# EAGLE schematic Flexboard (EAGLE 9.7.0), part 1 of 2

## Sheet 1 of 4: Microcontroller
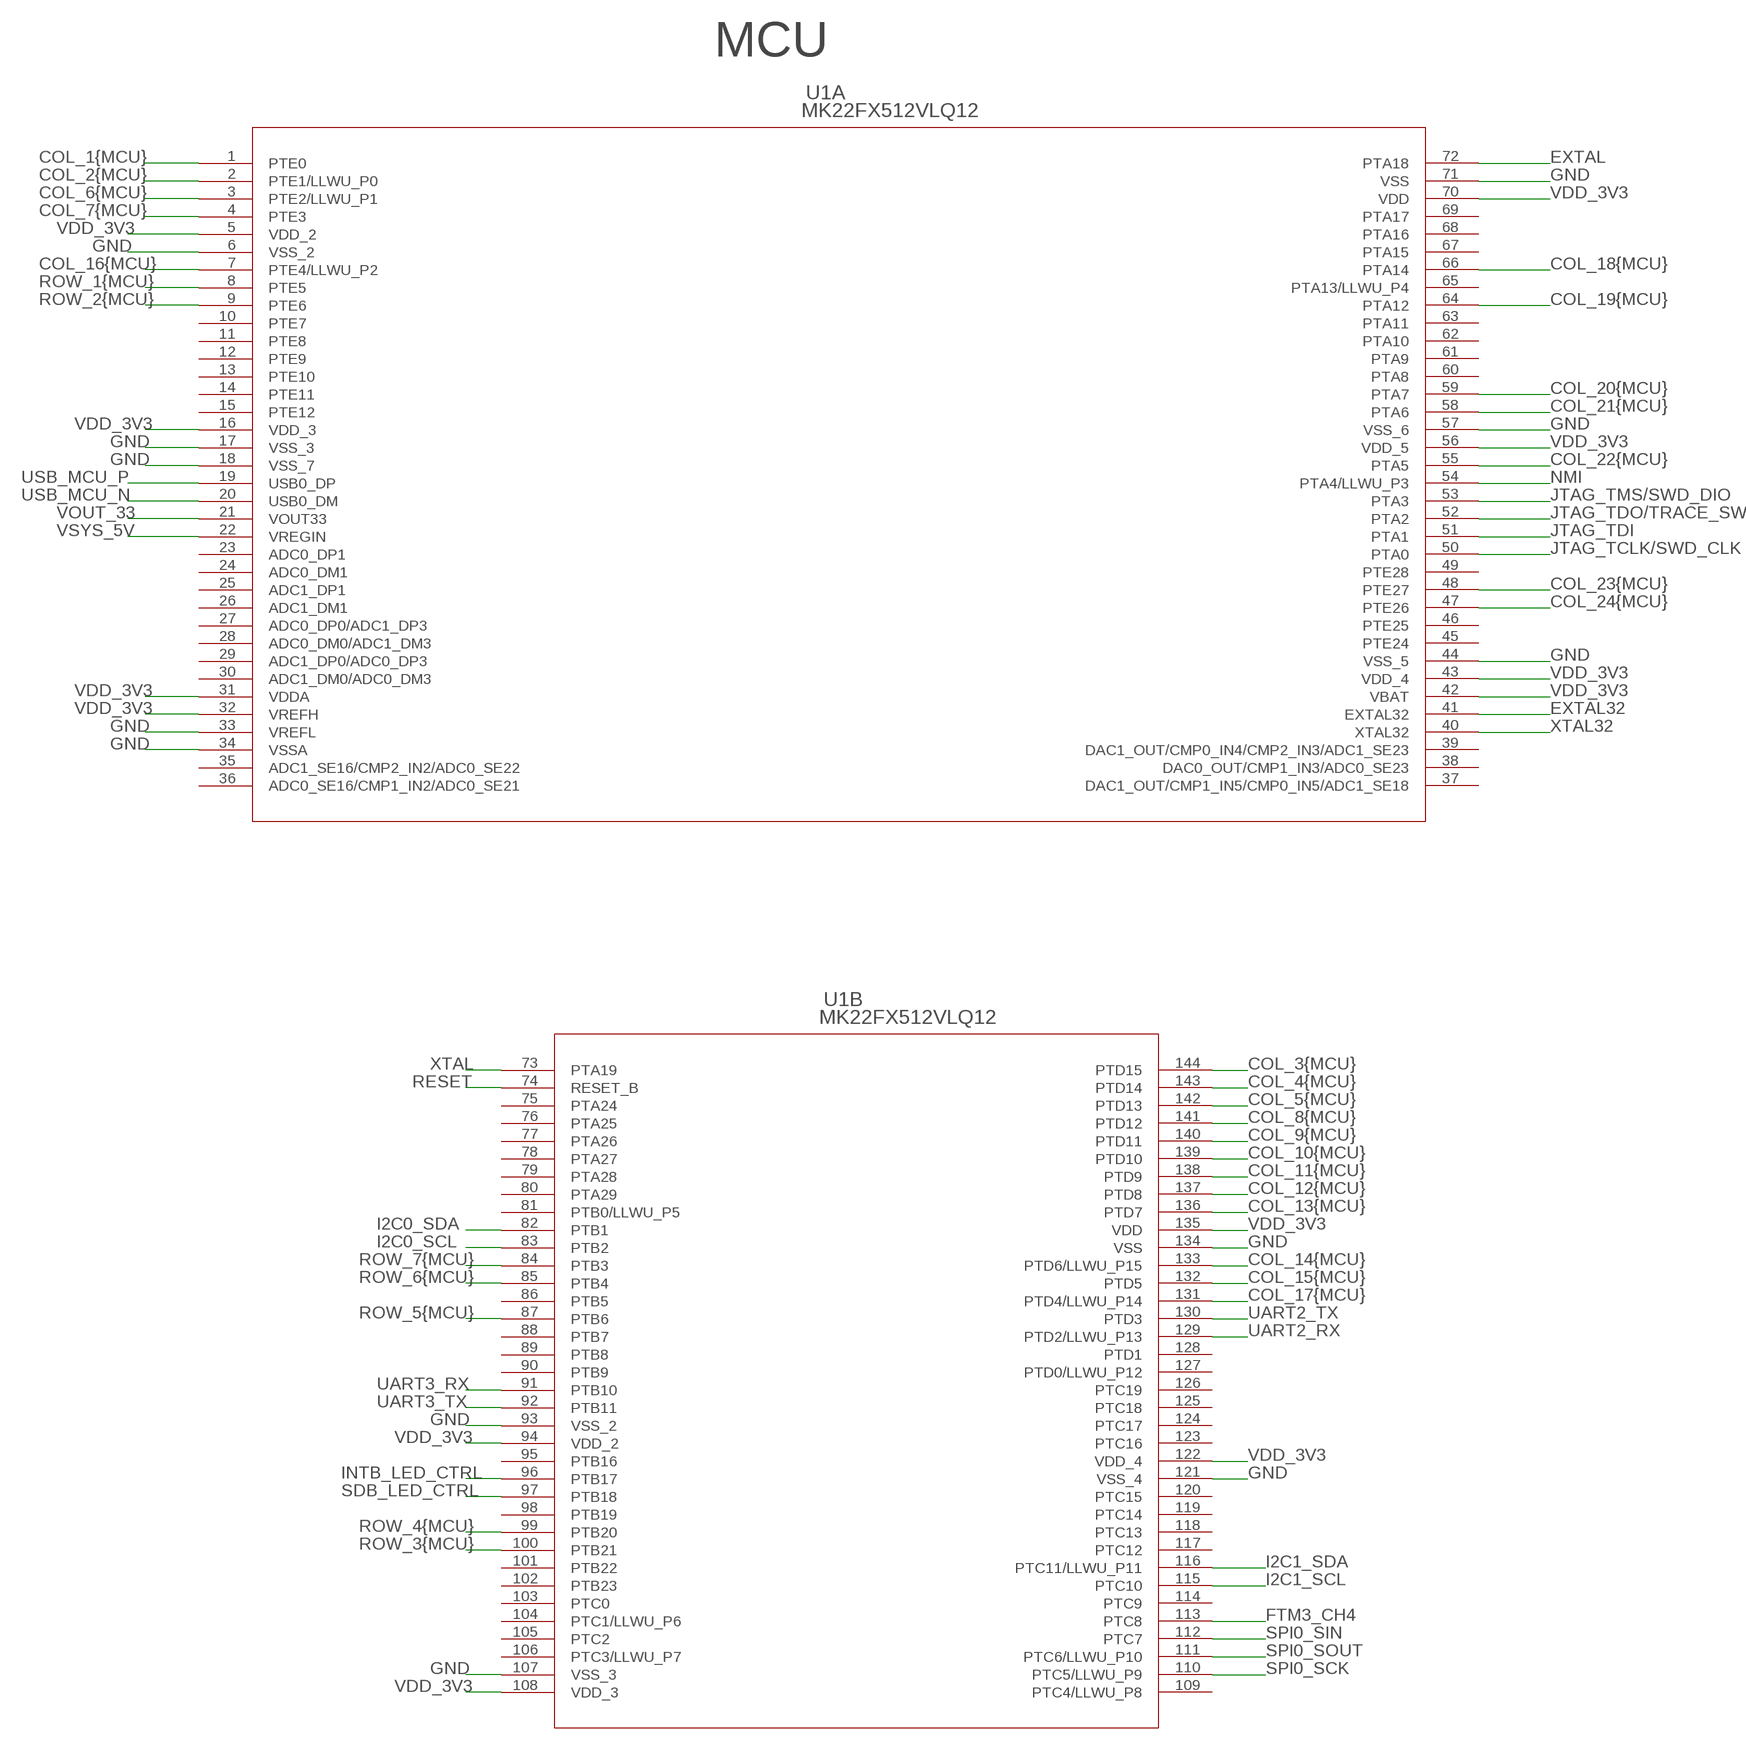
[diagram p0: schematic, sheet 1]

### Parts
U1  MK22FX512VLQ12  MK22FX512AVLQ12  [LQFP-144_20X20X1.6]

### Nets
COL_1{MCU}: U1.1(A:PTE0) ; also sheet 2
COL_2{MCU}: U1.2(A:PTE1/LLWU_P0) ; also sheet 2
COL_3{MCU}: U1.144(B:PTD15) ; also sheet 2
COL_4{MCU}: U1.143(B:PTD14) ; also sheet 2
COL_5{MCU}: U1.142(B:PTD13) ; also sheet 2
COL_6{MCU}: U1.3(A:PTE2/LLWU_P1) ; also sheet 2
COL_7{MCU}: U1.4(A:PTE3) ; also sheet 2
COL_8{MCU}: U1.141(B:PTD12) ; also sheet 2
COL_9{MCU}: U1.140(B:PTD11) ; also sheet 2
COL_10{MCU}: U1.139(B:PTD10) ; also sheet 2
COL_11{MCU}: U1.138(B:PTD9) ; also sheet 2
COL_12{MCU}: U1.137(B:PTD8) ; also sheet 2
COL_13{MCU}: U1.136(B:PTD7) ; also sheet 2
COL_14{MCU}: U1.133(B:PTD6/LLWU_P15) ; also sheet 2
COL_15{MCU}: U1.132(B:PTD5) ; also sheet 2
COL_16{MCU}: U1.7(A:PTE4/LLWU_P2) ; also sheet 2
COL_17{MCU}: U1.131(B:PTD4/LLWU_P14) ; also sheet 2
COL_18{MCU}: U1.66(A:PTA14) ; also sheet 2
COL_19{MCU}: U1.64(A:PTA12) ; also sheet 2
COL_20{MCU}: U1.59(A:PTA7) ; also sheet 2
COL_21{MCU}: U1.58(A:PTA6) ; also sheet 2
COL_22{MCU}: U1.55(A:PTA5) ; also sheet 2
COL_23{MCU}: U1.48(A:PTE27) ; also sheet 2
COL_24{MCU}: U1.47(A:PTE26) ; also sheet 2
EXTAL: U1.72(A:PTA18) ; also sheet 2
EXTAL32: U1.41(A:EXTAL32) ; also sheet 2
FTM3_CH4: U1.113(B:PTC8) ; also sheet 2
GND: U1.6(A:VSS_2) U1.17(A:VSS_3) U1.18(A:VSS_7) U1.33(A:VREFL) U1.34(A:VSSA) U1.44(A:VSS_5) U1.57(A:VSS_6) U1.71(A:VSS) U1.93(B:VSS_2) U1.107(B:VSS_3) U1.121(B:VSS_4) U1.134(B:VSS) ; also sheet 2,4
I2C0_SCL: U1.83(B:PTB2) ; also sheet 4
I2C0_SDA: U1.82(B:PTB1) ; also sheet 4
I2C1_SCL: U1.115(B:PTC10) ; also sheet 2
I2C1_SDA: U1.116(B:PTC11/LLWU_P11) ; also sheet 2
INTB_LED_CTRL: U1.96(B:PTB17) ; also sheet 4
JTAG_TCLK/SWD_CLK: U1.50(A:PTA0) ; also sheet 2
JTAG_TDI: U1.51(A:PTA1) ; also sheet 2
JTAG_TDO/TRACE_SWO: U1.52(A:PTA2) ; also sheet 2
JTAG_TMS/SWD_DIO: U1.53(A:PTA3) ; also sheet 2
NMI: U1.54(A:PTA4/LLWU_P3) ; also sheet 2
RESET: U1.74(B:RESET_B) ; also sheet 2
ROW_1{MCU}: U1.8(A:PTE5) ; also sheet 2
ROW_2{MCU}: U1.9(A:PTE6) ; also sheet 2
ROW_3{MCU}: U1.100(B:PTB21) ; also sheet 2
ROW_4{MCU}: U1.99(B:PTB20) ; also sheet 2
ROW_5{MCU}: U1.87(B:PTB6) ; also sheet 2
ROW_6{MCU}: U1.85(B:PTB4) ; also sheet 2
ROW_7{MCU}: U1.84(B:PTB3) ; also sheet 2
SDB_LED_CTRL: U1.97(B:PTB18) ; also sheet 4
SPI0_SCK: U1.110(B:PTC5/LLWU_P9) ; also sheet 2
SPI0_SIN: U1.112(B:PTC7) ; also sheet 2
SPI0_SOUT: U1.111(B:PTC6/LLWU_P10) ; also sheet 2
UART2_RX: U1.129(B:PTD2/LLWU_P13) ; also sheet 2
UART2_TX: U1.130(B:PTD3) ; also sheet 2
UART3_RX: U1.91(B:PTB10) ; also sheet 2
UART3_TX: U1.92(B:PTB11) ; also sheet 2
USB_MCU_N: U1.20(A:USB0_DM) ; also sheet 2
USB_MCU_P: U1.19(A:USB0_DP) ; also sheet 2
VDD_3V3: U1.5(A:VDD_2) U1.16(A:VDD_3) U1.31(A:VDDA) U1.32(A:VREFH) U1.42(A:VBAT) U1.43(A:VDD_4) U1.56(A:VDD_5) U1.70(A:VDD) U1.94(B:VDD_2) U1.108(B:VDD_3) U1.122(B:VDD_4) U1.135(B:VDD) ; also sheet 2,4
VOUT_33: U1.21(A:VOUT33) ; also sheet 2
VSYS_5V: U1.22(A:VREGIN) ; also sheet 2
XTAL: U1.73(B:PTA19) ; also sheet 2
XTAL32: U1.40(A:XTAL32) ; also sheet 2
Unconnected: U1.10(A:PTE7) U1.11(A:PTE8) U1.12(A:PTE9) U1.13(A:PTE10) U1.14(A:PTE11) U1.15(A:PTE12) U1.23(A:ADC0_DP1) U1.24(A:ADC0_DM1) U1.25(A:ADC1_DP1) U1.26(A:ADC1_DM1) U1.27(A:ADC0_DP0/ADC1_DP3) U1.28(A:ADC0_DM0/ADC1_DM3) U1.29(A:ADC1_DP0/ADC0_DP3) U1.30(A:ADC1_DM0/ADC0_DM3) U1.35(A:ADC1_SE16/CMP2_IN2/ADC0_SE22) U1.36(A:ADC0_SE16/CMP1_IN2/ADC0_SE21) U1.37(A:DAC1_OUT/CMP1_IN5/CMP0_IN5/ADC1_SE18) U1.38(A:DAC0_OUT/CMP1_IN3/ADC0_SE23) U1.39(A:DAC1_OUT/CMP0_IN4/CMP2_IN3/ADC1_SE23) U1.45(A:PTE24) U1.46(A:PTE25) U1.49(A:PTE28) U1.60(A:PTA8) U1.61(A:PTA9) U1.62(A:PTA10) U1.63(A:PTA11) U1.65(A:PTA13/LLWU_P4) U1.67(A:PTA15) U1.68(A:PTA16) U1.69(A:PTA17) U1.75(B:PTA24) U1.76(B:PTA25) U1.77(B:PTA26) U1.78(B:PTA27) U1.79(B:PTA28) U1.80(B:PTA29) U1.81(B:PTB0/LLWU_P5) U1.86(B:PTB5) U1.88(B:PTB7) U1.89(B:PTB8) U1.90(B:PTB9) U1.95(B:PTB16) U1.98(B:PTB19) U1.101(B:PTB22) U1.102(B:PTB23) U1.103(B:PTC0) U1.104(B:PTC1/LLWU_P6) U1.105(B:PTC2) U1.106(B:PTC3/LLWU_P7) U1.109(B:PTC4/LLWU_P8) U1.114(B:PTC9) U1.117(B:PTC12) U1.118(B:PTC13) U1.119(B:PTC14) U1.120(B:PTC15) U1.123(B:PTC16) U1.124(B:PTC17) U1.125(B:PTC18) U1.126(B:PTC19) U1.127(B:PTD0/LLWU_P12) U1.128(B:PTD1)

### Notes on the sheet
- MCU

## Sheet 2 of 4: MCU Support
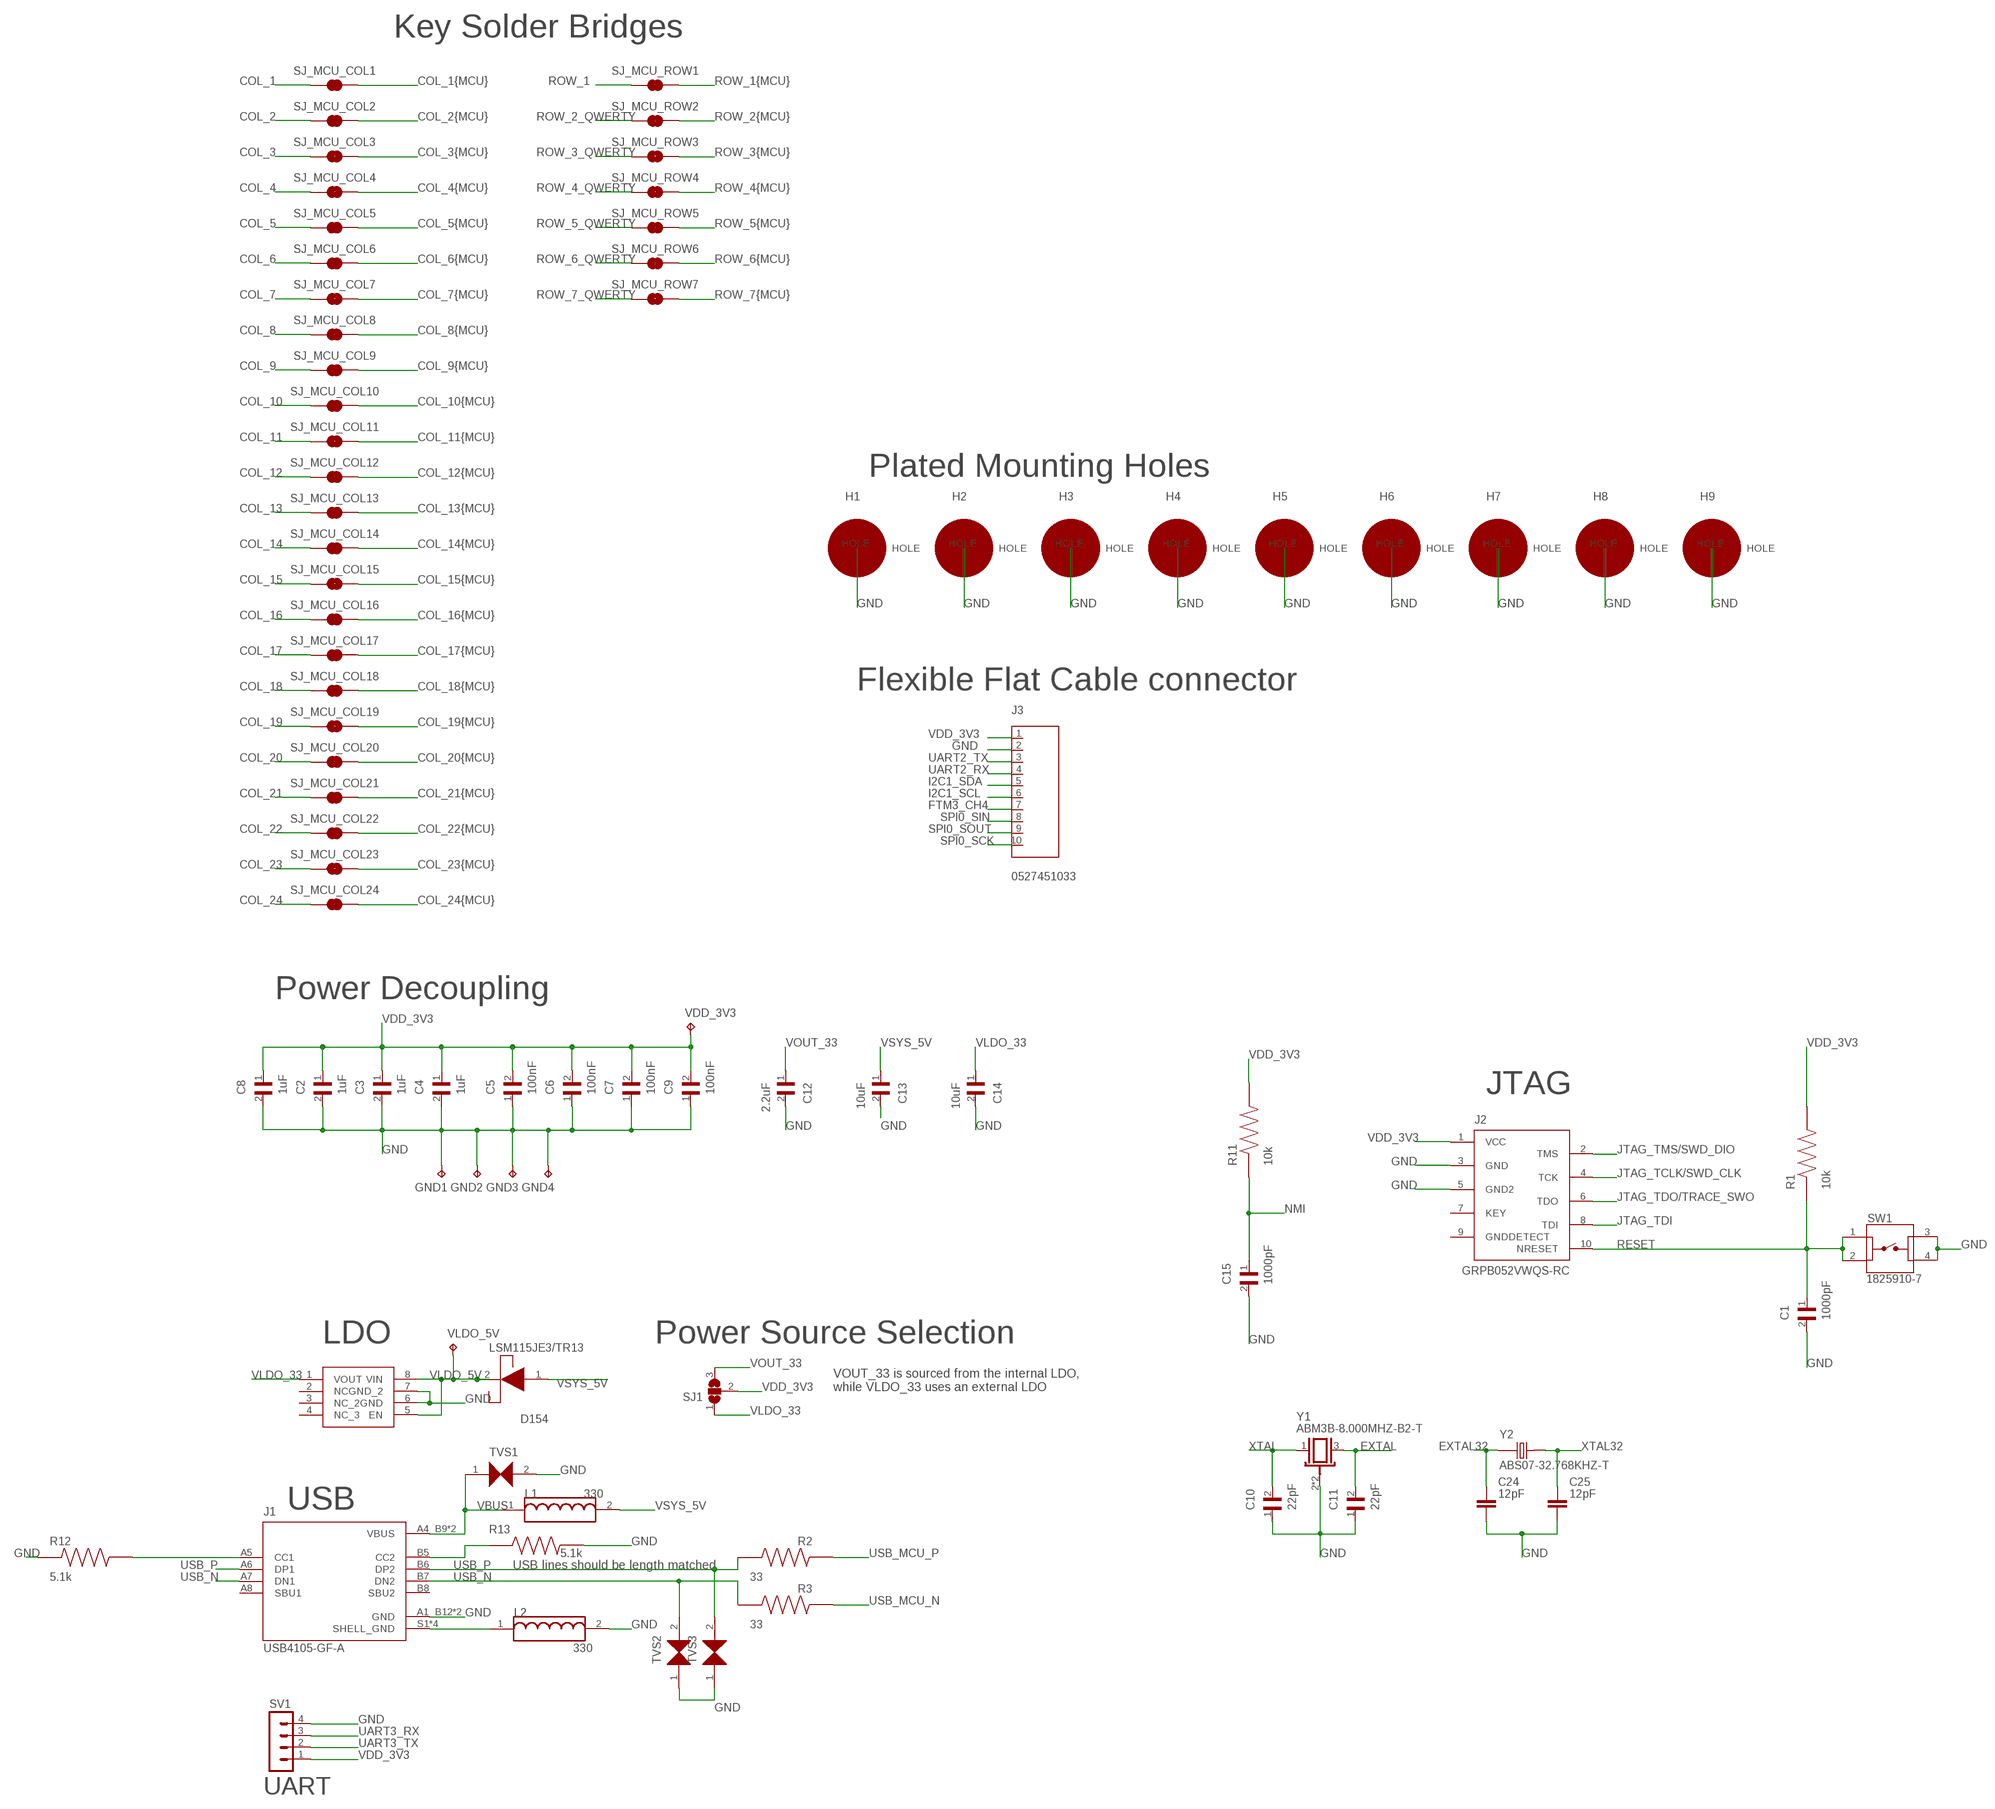
[diagram p1: schematic, sheet 2]

### Parts
C1  1000pF  C1206C102K1RACAUTO  [CAPC3216X110N]
C2  1uF  GCM31MR71H105KA55L  [CAPC3216X125N]
C3  1uF  GCM31MR71H105KA55L  [CAPC3216X125N]
C4  1uF  GCM31MR71H105KA55L  [CAPC3216X125N]
C5  100nF  C1206C104K5RAC7800  [CAPC3216X88N]
C6  100nF  C1206C104K5RAC7800  [CAPC3216X88N]
C7  100nF  C1206C104K5RAC7800  [CAPC3216X88N]
C8  1uF  GCM31MR71H105KA55L  [CAPC3216X125N]
C9  100nF  C1206C104K5RAC7800  [CAPC3216X88N]
C10  22pF  C1206C220JGGAC7800  [CAPC3216X110N]
C11  22pF  C1206C220JGGAC7800  [CAPC3216X110N]
C12  2.2uF  1206ZC225MAT2A  [CAPC3216X178N]
C13  10uF  GRM21BC8YA106ME11L  [CAPC2012X145N]
C14  10uF  GRM21BC8YA106ME11L  [CAPC2012X145N]
C15  1000pF  C1206C102K1RACAUTO  [CAPC3216X110N]
C24  12pF  C_CHIP-0805(2012-METRIC)  [CAPC2012X110]
C25  12pF  C_CHIP-0805(2012-METRIC)  [CAPC2012X110]
D154  LSM115JE3/TR13  [LSM115JE3/TR13]
GND1  TPB2,54  [B2,54]
GND2  TPB2,54  [B2,54]
GND3  TPB2,54  [B2,54]
GND4  TPB2,54  [B2,54]
H1  PTH  [PTH]
H2  PTH  [PTH]
H3  PTH  [PTH]
H4  PTH  [PTH]
H5  PTH  [PTH]
H6  PTH  [PTH]
H7  PTH  [PTH]
H8  PTH  [PTH]
H9  PTH  [PTH]
J1  USB4105-GF-A  [GCT_USB4105-GF-A]
J2  GRPB052VWQS-RC  [DEBUG]
J3  0527451033  [52745-1033]
L1  330  782853331SMD  [78285333]
L2  330  782853331SMD  [78285333]
R1  10k  CRGCQ1206J10K  [RESC3115X65N]
R2  33  CRG0805F33R  [RESC2012X65N]
R3  33  CRG0805F33R  [RESC2012X65N]
R11  10k  CRGCQ1206J10K  [RESC3115X65N]
R12  5.1k  RNCP0805FTD20R0  [RESC2012X60N]
R13  5.1k  RNCP0805FTD20R0  [RESC2012X60N]
SJ1  SJ2W  [SJ_2]
SJ_MCU_COL1  JUMPER-SMT_2_NC_TRACE_NO-SILK  [SMT-JUMPER_2_NC_TRACE_NO-SILK]
SJ_MCU_COL2  JUMPER-SMT_2_NC_TRACE_NO-SILK  [SMT-JUMPER_2_NC_TRACE_NO-SILK]
SJ_MCU_COL3  JUMPER-SMT_2_NC_TRACE_NO-SILK  [SMT-JUMPER_2_NC_TRACE_NO-SILK]
SJ_MCU_COL4  JUMPER-SMT_2_NC_TRACE_NO-SILK  [SMT-JUMPER_2_NC_TRACE_NO-SILK]
SJ_MCU_COL5  JUMPER-SMT_2_NC_TRACE_NO-SILK  [SMT-JUMPER_2_NC_TRACE_NO-SILK]
SJ_MCU_COL6  JUMPER-SMT_2_NC_TRACE_NO-SILK  [SMT-JUMPER_2_NC_TRACE_NO-SILK]
SJ_MCU_COL7  JUMPER-SMT_2_NC_TRACE_NO-SILK  [SMT-JUMPER_2_NC_TRACE_NO-SILK]
SJ_MCU_COL8  JUMPER-SMT_2_NC_TRACE_NO-SILK  [SMT-JUMPER_2_NC_TRACE_NO-SILK]
SJ_MCU_COL9  JUMPER-SMT_2_NC_TRACE_NO-SILK  [SMT-JUMPER_2_NC_TRACE_NO-SILK]
SJ_MCU_COL10  JUMPER-SMT_2_NC_TRACE_NO-SILK  [SMT-JUMPER_2_NC_TRACE_NO-SILK]
SJ_MCU_COL11  JUMPER-SMT_2_NC_TRACE_NO-SILK  [SMT-JUMPER_2_NC_TRACE_NO-SILK]
SJ_MCU_COL12  JUMPER-SMT_2_NC_TRACE_NO-SILK  [SMT-JUMPER_2_NC_TRACE_NO-SILK]
SJ_MCU_COL13  JUMPER-SMT_2_NC_TRACE_NO-SILK  [SMT-JUMPER_2_NC_TRACE_NO-SILK]
SJ_MCU_COL14  JUMPER-SMT_2_NC_TRACE_NO-SILK  [SMT-JUMPER_2_NC_TRACE_NO-SILK]
SJ_MCU_COL15  JUMPER-SMT_2_NC_TRACE_NO-SILK  [SMT-JUMPER_2_NC_TRACE_NO-SILK]
SJ_MCU_COL16  JUMPER-SMT_2_NC_TRACE_NO-SILK  [SMT-JUMPER_2_NC_TRACE_NO-SILK]
SJ_MCU_COL17  JUMPER-SMT_2_NC_TRACE_NO-SILK  [SMT-JUMPER_2_NC_TRACE_NO-SILK]
SJ_MCU_COL18  JUMPER-SMT_2_NC_TRACE_NO-SILK  [SMT-JUMPER_2_NC_TRACE_NO-SILK]
SJ_MCU_COL19  JUMPER-SMT_2_NC_TRACE_NO-SILK  [SMT-JUMPER_2_NC_TRACE_NO-SILK]
SJ_MCU_COL20  JUMPER-SMT_2_NC_TRACE_NO-SILK  [SMT-JUMPER_2_NC_TRACE_NO-SILK]
SJ_MCU_COL21  JUMPER-SMT_2_NC_TRACE_NO-SILK  [SMT-JUMPER_2_NC_TRACE_NO-SILK]
SJ_MCU_COL22  JUMPER-SMT_2_NC_TRACE_NO-SILK  [SMT-JUMPER_2_NC_TRACE_NO-SILK]
SJ_MCU_COL23  JUMPER-SMT_2_NC_TRACE_NO-SILK  [SMT-JUMPER_2_NC_TRACE_NO-SILK]
SJ_MCU_COL24  JUMPER-SMT_2_NC_TRACE_NO-SILK  [SMT-JUMPER_2_NC_TRACE_NO-SILK]
SJ_MCU_ROW1  JUMPER-SMT_2_NC_TRACE_NO-SILK  [SMT-JUMPER_2_NC_TRACE_NO-SILK]
SJ_MCU_ROW2  JUMPER-SMT_2_NC_TRACE_NO-SILK  [SMT-JUMPER_2_NC_TRACE_NO-SILK]
SJ_MCU_ROW3  JUMPER-SMT_2_NC_TRACE_NO-SILK  [SMT-JUMPER_2_NC_TRACE_NO-SILK]
SJ_MCU_ROW4  JUMPER-SMT_2_NC_TRACE_NO-SILK  [SMT-JUMPER_2_NC_TRACE_NO-SILK]
SJ_MCU_ROW5  JUMPER-SMT_2_NC_TRACE_NO-SILK  [SMT-JUMPER_2_NC_TRACE_NO-SILK]
SJ_MCU_ROW6  JUMPER-SMT_2_NC_TRACE_NO-SILK  [SMT-JUMPER_2_NC_TRACE_NO-SILK]
SJ_MCU_ROW7  JUMPER-SMT_2_NC_TRACE_NO-SILK  [SMT-JUMPER_2_NC_TRACE_NO-SILK]
SV1  MA04-1  [MA04-1]
SW1  1825910-7  [SW_1825910-7]
TVS1  0603ESDA2-TR2  [0603ESDA2-TR2]
TVS2  0603ESDA2-TR2  [0603ESDA2-TR2]
TVS3  0603ESDA2-TR2  [0603ESDA2-TR2]
U2  AP2115M-3.3TRG1  [SOIC127P600X175-8N]
VDD_3V3  TPB2,54  [B2,54]
VLDO_5V  TPB2,54  [B2,54]
Y1  ABM3B-8.000MHZ-B2-T  [OSC_ABM3B-8.000MHZ-B2-T]
Y2  ABS07-32.768KHZ-T  [XTAL_ABS07-32.768KHZ-T]

### Nets
COL_1: SJ_MCU_COL1.1 ; also sheet 3
COL_1{MCU}: SJ_MCU_COL1.2 ; also sheet 1
COL_2: SJ_MCU_COL2.1 ; also sheet 3
COL_2{MCU}: SJ_MCU_COL2.2 ; also sheet 1
COL_3: SJ_MCU_COL3.1 ; also sheet 3
COL_3{MCU}: SJ_MCU_COL3.2 ; also sheet 1
COL_4: SJ_MCU_COL4.1 ; also sheet 3
COL_4{MCU}: SJ_MCU_COL4.2 ; also sheet 1
COL_5: SJ_MCU_COL5.1 ; also sheet 3
COL_5{MCU}: SJ_MCU_COL5.2 ; also sheet 1
COL_6: SJ_MCU_COL6.1 ; also sheet 3
COL_6{MCU}: SJ_MCU_COL6.2 ; also sheet 1
COL_7: SJ_MCU_COL7.1 ; also sheet 3
COL_7{MCU}: SJ_MCU_COL7.2 ; also sheet 1
COL_8: SJ_MCU_COL8.1 ; also sheet 3
COL_8{MCU}: SJ_MCU_COL8.2 ; also sheet 1
COL_9: SJ_MCU_COL9.1 ; also sheet 3
COL_9{MCU}: SJ_MCU_COL9.2 ; also sheet 1
COL_10: SJ_MCU_COL10.1 ; also sheet 3
COL_10{MCU}: SJ_MCU_COL10.2 ; also sheet 1
COL_11: SJ_MCU_COL11.1 ; also sheet 3
COL_11{MCU}: SJ_MCU_COL11.2 ; also sheet 1
COL_12: SJ_MCU_COL12.1 ; also sheet 3
COL_12{MCU}: SJ_MCU_COL12.2 ; also sheet 1
COL_13: SJ_MCU_COL13.1 ; also sheet 3
COL_13{MCU}: SJ_MCU_COL13.2 ; also sheet 1
COL_14: SJ_MCU_COL14.1 ; also sheet 3
COL_14{MCU}: SJ_MCU_COL14.2 ; also sheet 1
COL_15: SJ_MCU_COL15.1 ; also sheet 3
COL_15{MCU}: SJ_MCU_COL15.2 ; also sheet 1
COL_16: SJ_MCU_COL16.1 ; also sheet 3
COL_16{MCU}: SJ_MCU_COL16.2 ; also sheet 1
COL_17: SJ_MCU_COL17.1 ; also sheet 3
COL_17{MCU}: SJ_MCU_COL17.2 ; also sheet 1
COL_18: SJ_MCU_COL18.1 ; also sheet 3
COL_18{MCU}: SJ_MCU_COL18.2 ; also sheet 1
COL_19: SJ_MCU_COL19.1 ; also sheet 3
COL_19{MCU}: SJ_MCU_COL19.2 ; also sheet 1
COL_20: SJ_MCU_COL20.1 ; also sheet 3
COL_20{MCU}: SJ_MCU_COL20.2 ; also sheet 1
COL_21: SJ_MCU_COL21.1 ; also sheet 3
COL_21{MCU}: SJ_MCU_COL21.2 ; also sheet 1
COL_22: SJ_MCU_COL22.1 ; also sheet 3
COL_22{MCU}: SJ_MCU_COL22.2 ; also sheet 1
COL_23: SJ_MCU_COL23.1 ; also sheet 3
COL_23{MCU}: SJ_MCU_COL23.2 ; also sheet 1
COL_24: SJ_MCU_COL24.1 ; also sheet 3
COL_24{MCU}: SJ_MCU_COL24.2 ; also sheet 1
EXTAL: C11.2 Y1.3 ; also sheet 1
EXTAL32: C24.1 Y2.1 ; also sheet 1
FTM3_CH4: J3.7 ; also sheet 1
GND: C1.2 C2.2 C3.2 C4.2 C5.1 C6.1 C7.1 C8.2 C9.1 C10.1 C11.1 C12.2 C13.2 C14.2 C15.2 C24.2 C25.2 GND1.TP GND2.TP GND3.TP GND4.TP H1.HOLE H2.HOLE H3.HOLE H4.HOLE H5.HOLE H6.HOLE H7.HOLE H8.HOLE H9.HOLE J1.A1_B12(GND) J1.B1_A12(GND) J2.3(GND) J2.5(GND2) J3.2 L2.2 R12.1 R13.2 SV1.4 SW1.3 SW1.4 TVS1.2 TVS2.1 TVS3.1 U2.6(GND) U2.7(GND_2) Y1.2(GND) Y1.4(GND) ; also sheet 1,4
I2C1_SCL: J3.6 ; also sheet 1
I2C1_SDA: J3.5 ; also sheet 1
JTAG_TCLK/SWD_CLK: J2.4(TCK) ; also sheet 1
JTAG_TDI: J2.8(TDI) ; also sheet 1
JTAG_TDO/TRACE_SWO: J2.6(TDO) ; also sheet 1
JTAG_TMS/SWD_DIO: J2.2(TMS) ; also sheet 1
N$1: J1.S1(SHELL_GND) J1.S2(SHELL_GND) J1.S3(SHELL_GND) J1.S4(SHELL_GND) L2.1
N$214: J1.B5(CC2) R13.1
N$215: J1.A5(CC1) R12.2
NMI: C15.1 R11.1 ; also sheet 1
RESET: C1.1 J2.10(NRESET) R1.1 SW1.1 SW1.2 ; also sheet 1
ROW_1: SJ_MCU_ROW1.1 ; also sheet 3
ROW_1{MCU}: SJ_MCU_ROW1.2 ; also sheet 1
ROW_2_QWERTY: SJ_MCU_ROW2.1 ; also sheet 3
ROW_2{MCU}: SJ_MCU_ROW2.2 ; also sheet 1
ROW_3_QWERTY: SJ_MCU_ROW3.1 ; also sheet 3
ROW_3{MCU}: SJ_MCU_ROW3.2 ; also sheet 1
ROW_4_QWERTY: SJ_MCU_ROW4.1 ; also sheet 3
ROW_4{MCU}: SJ_MCU_ROW4.2 ; also sheet 1
ROW_5_QWERTY: SJ_MCU_ROW5.1 ; also sheet 3
ROW_5{MCU}: SJ_MCU_ROW5.2 ; also sheet 1
ROW_6_QWERTY: SJ_MCU_ROW6.1 ; also sheet 3
ROW_6{MCU}: SJ_MCU_ROW6.2 ; also sheet 1
ROW_7_QWERTY: SJ_MCU_ROW7.1 ; also sheet 3
ROW_7{MCU}: SJ_MCU_ROW7.2 ; also sheet 1
SPI0_SCK: J3.10 ; also sheet 1
SPI0_SIN: J3.8 ; also sheet 1
SPI0_SOUT: J3.9 ; also sheet 1
UART2_RX: J3.4 ; also sheet 1
UART2_TX: J3.3 ; also sheet 1
UART3_RX: SV1.3 ; also sheet 1
UART3_TX: SV1.2 ; also sheet 1
USB_MCU_N: R3.2 ; also sheet 1
USB_MCU_P: R2.2 ; also sheet 1
USB_N: J1.A7(DN1) J1.B7(DN2) R3.1 TVS2.2
USB_P: J1.A6(DP1) J1.B6(DP2) R2.1 TVS3.2
VBUS: J1.A4_B9(VBUS) J1.B4_A9(VBUS) L1.1 TVS1.1
VDD_3V3: C2.1 C3.1 C4.1 C5.2 C6.2 C7.2 C8.1 C9.2 J2.1(VCC) J3.1 R1.2 R11.2 SJ1.2 SV1.1 VDD_3V3.TP ; also sheet 1,4
VLDO_5V: D154.2(CATHODE) U2.5(EN) U2.8(VIN) VLDO_5V.TP ; also sheet 4
VLDO_33: C14.1 SJ1.1 U2.1(VOUT)
VOUT_33: C12.1 SJ1.3 ; also sheet 1
VSYS_5V: C13.1 D154.1(ANODE) L1.2 ; also sheet 1
XTAL: C10.2 Y1.1 ; also sheet 1
XTAL32: C25.1 Y2.2 ; also sheet 1
Unconnected: J1.A8(SBU1) J1.B8(SBU2) J2.7(KEY) J2.9(GNDDETECT) U2.2(NC) U2.3(NC_2) U2.4(NC_3)

### Notes on the sheet
- Key Solder Bridges
- Plated Mounting Holes
- Flexible Flat Cable connector
- Power Decoupling
- JTAG
- LDO | Power Source Selection
- VOUT_33 is sourced from the internal LDO,
  while VLDO_33 uses an external LDO
- USB
- USB lines should be length matched
- UART

## Sheet 3 of 4: Key matrix
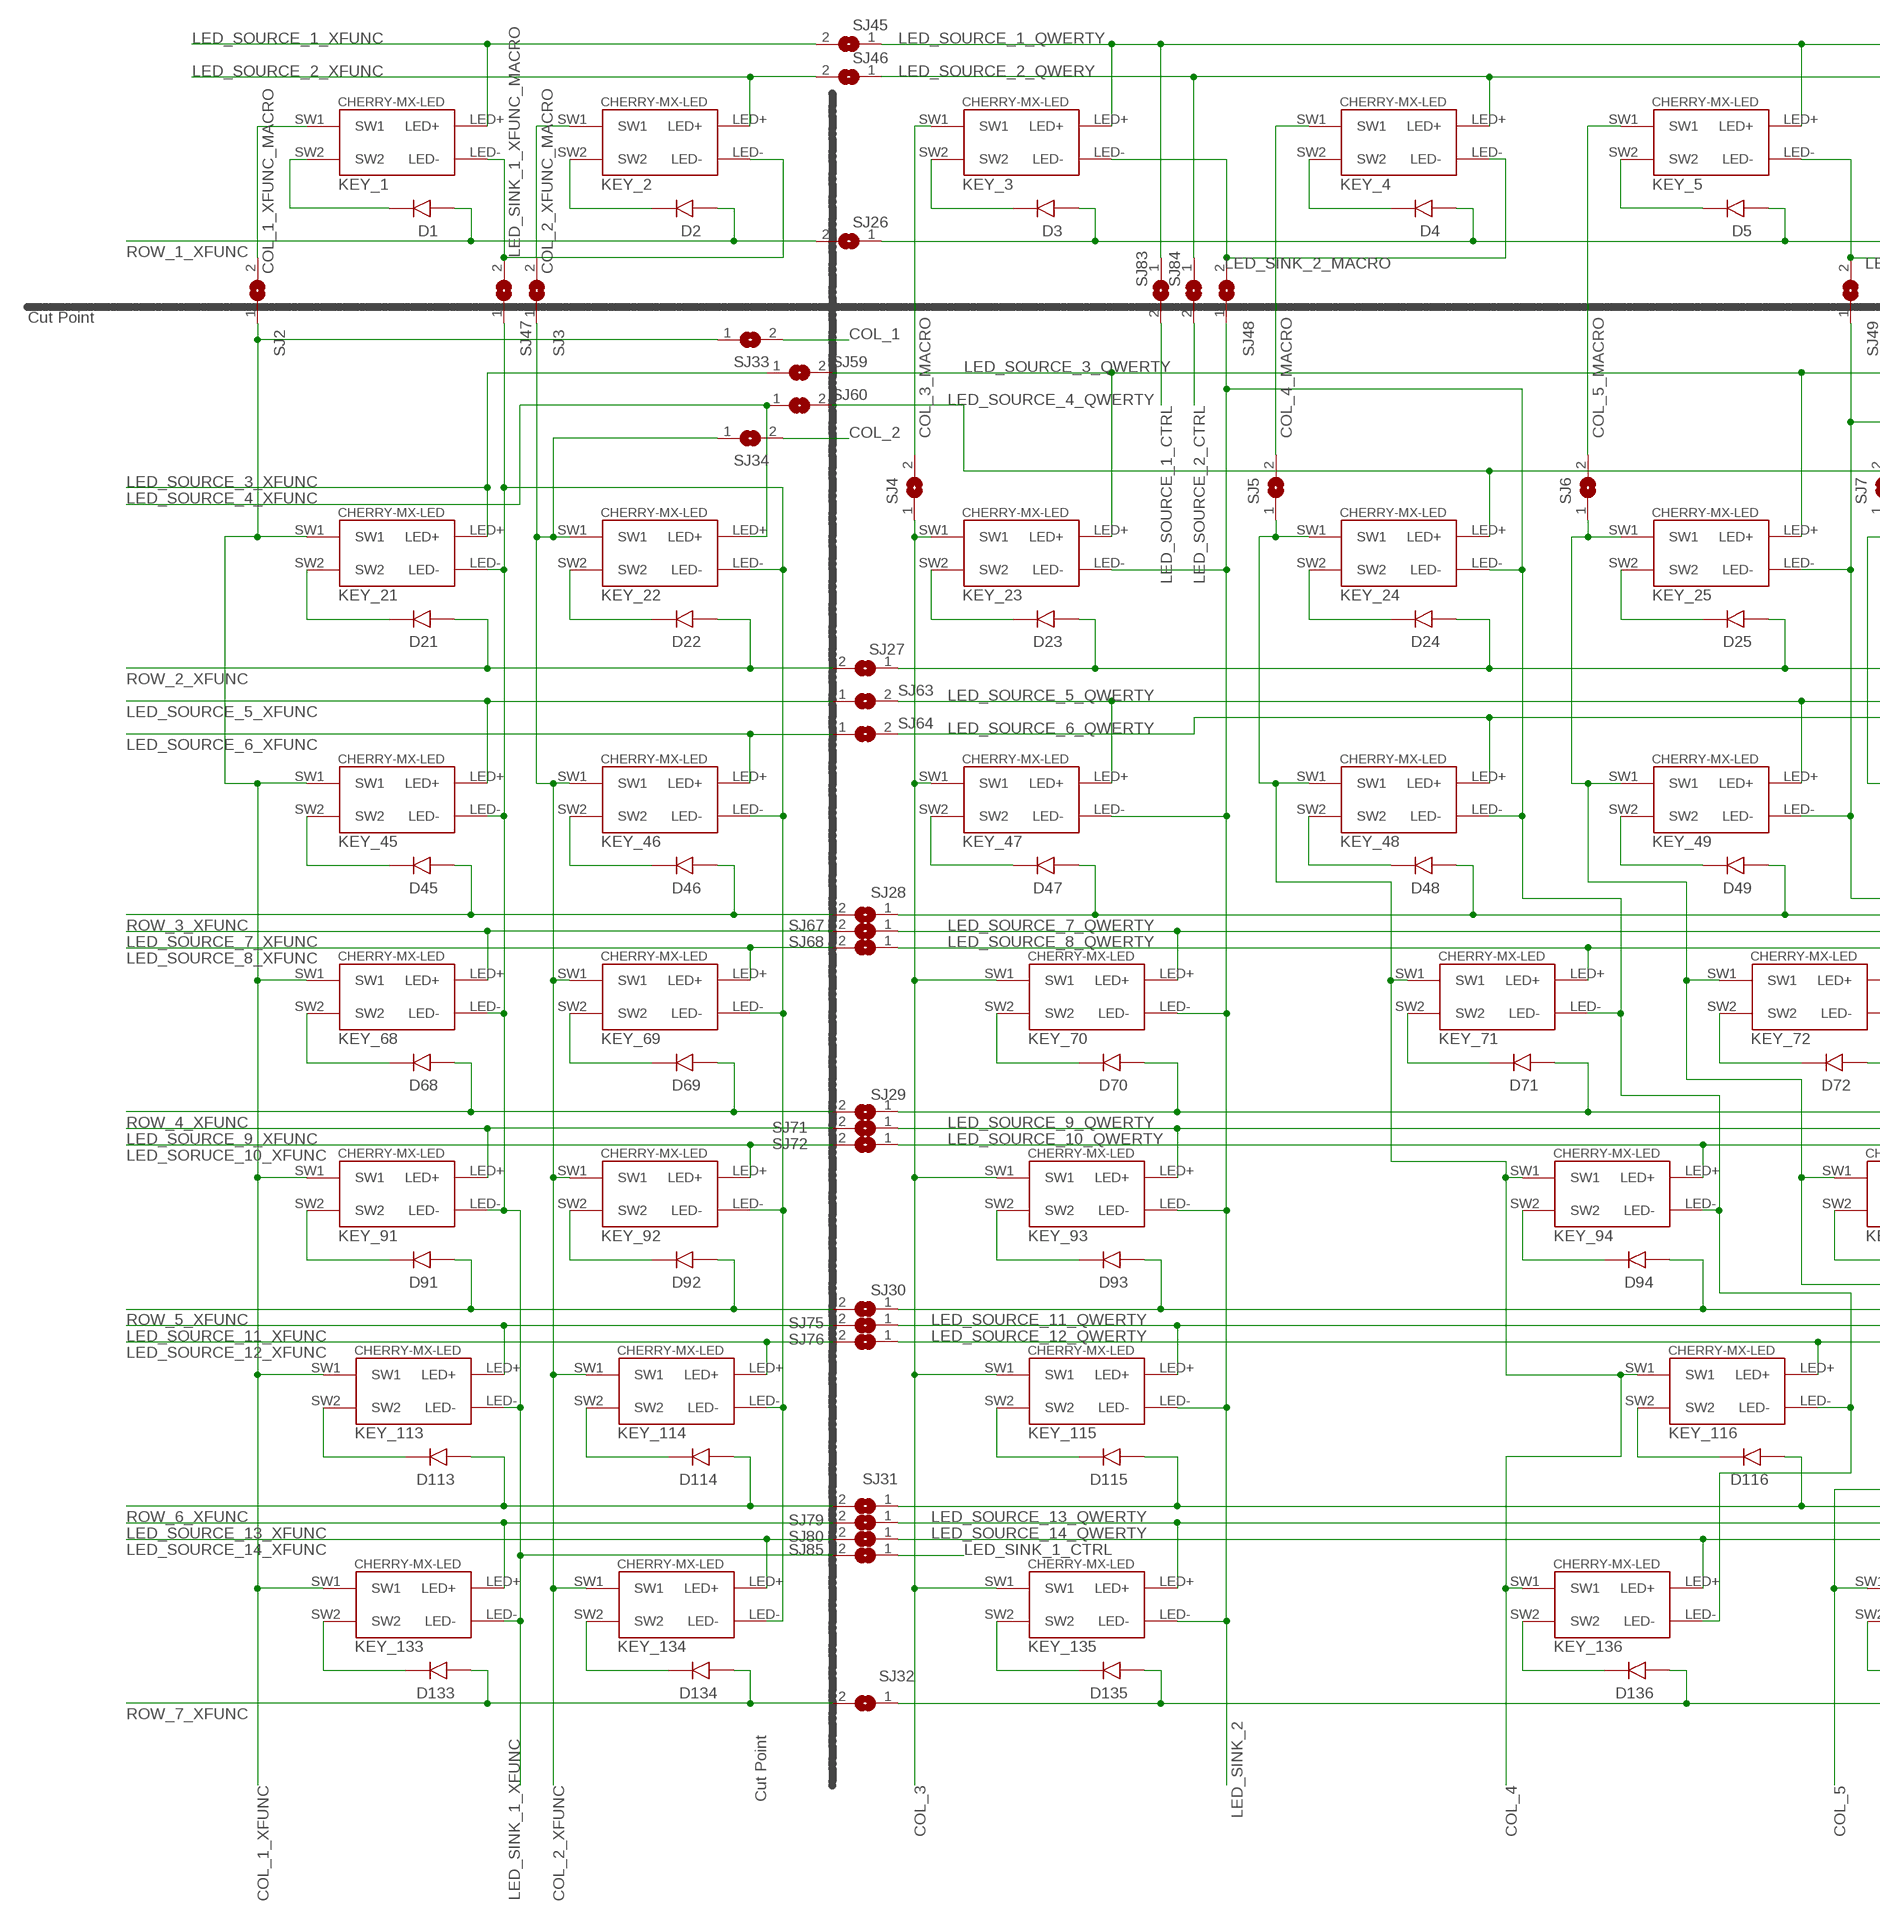
[diagram p2: schematic, sheet 3, part 1 of 3]
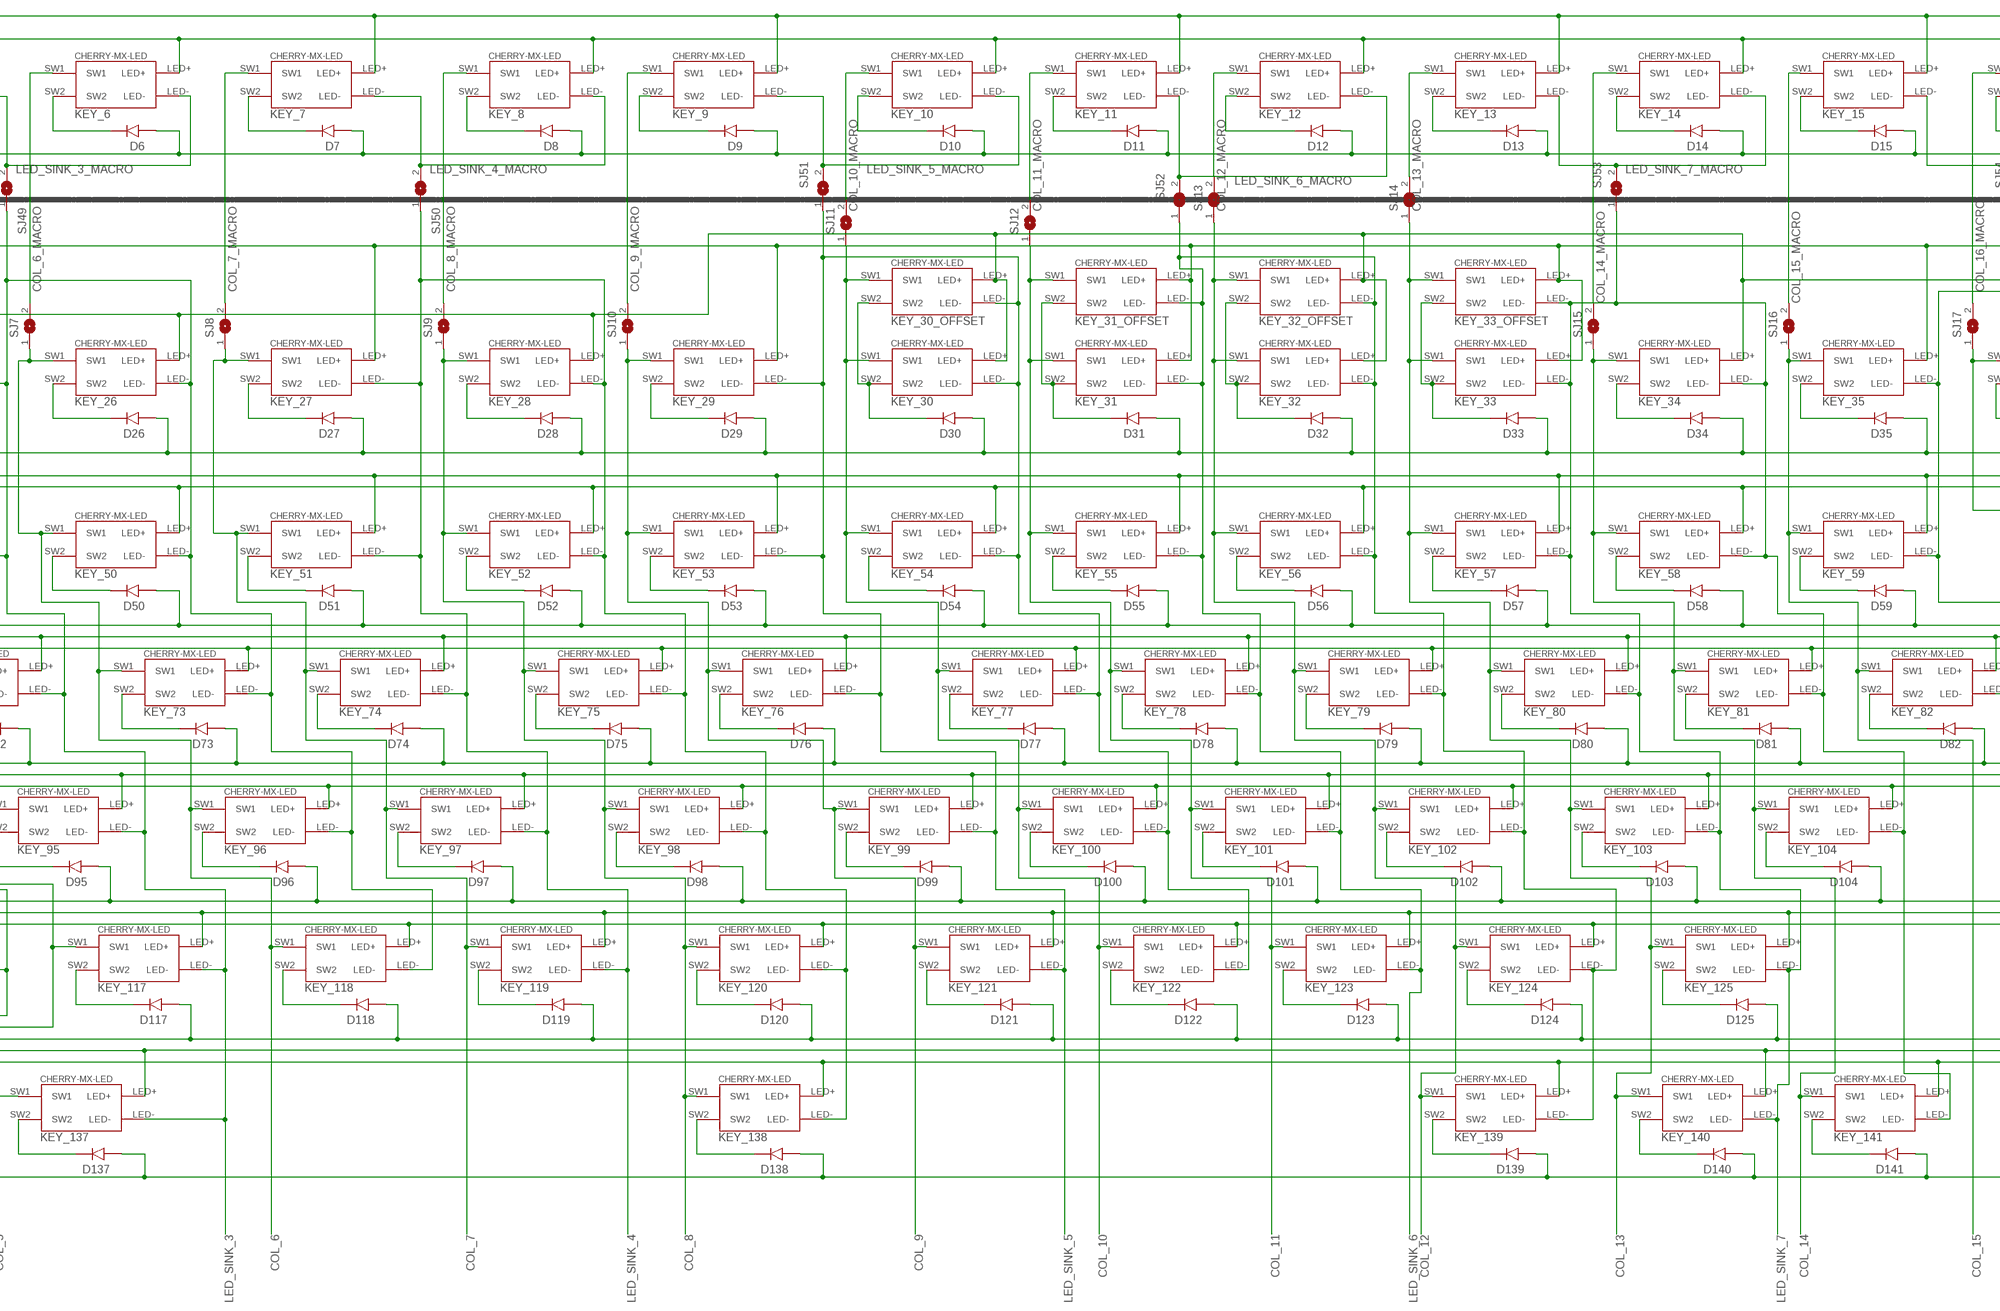
[diagram p3: schematic, sheet 3, part 2 of 3]
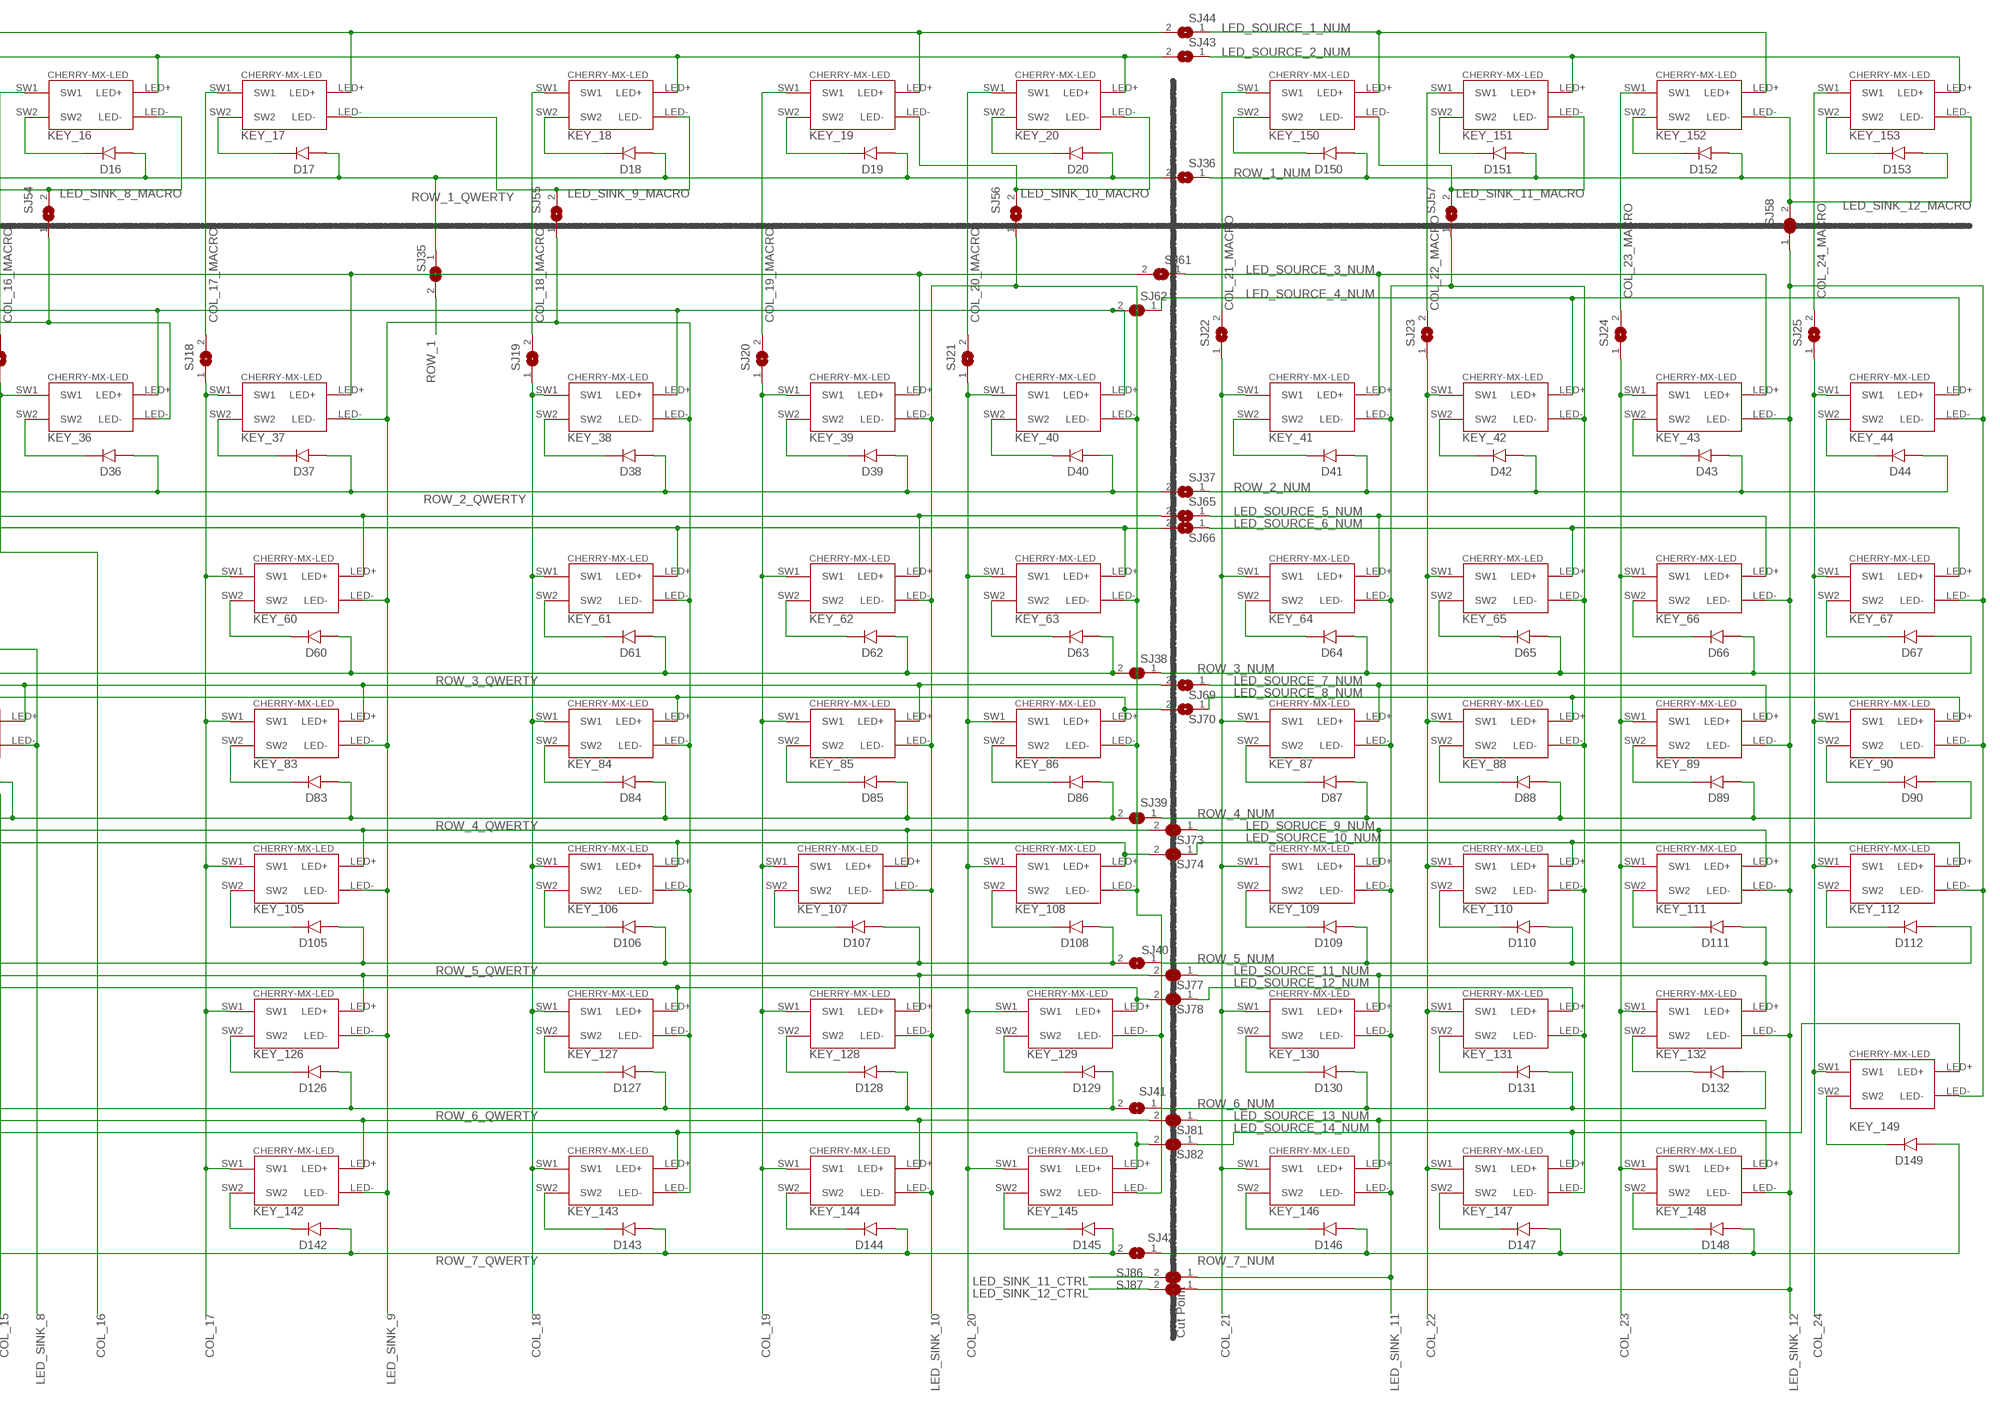
[diagram p4: schematic, sheet 3, part 3 of 3]

### Parts
D1  BAS16LT3G  [SOT95P240X111-3N]
D2  BAS16LT3G  [SOT95P240X111-3N]
D3  BAS16LT3G  [SOT95P240X111-3N]
D4  BAS16LT3G  [SOT95P240X111-3N]
D5  BAS16LT3G  [SOT95P240X111-3N]
D6  BAS16LT3G  [SOT95P240X111-3N]
D7  BAS16LT3G  [SOT95P240X111-3N]
D8  BAS16LT3G  [SOT95P240X111-3N]
D9  BAS16LT3G  [SOT95P240X111-3N]
D10  BAS16LT3G  [SOT95P240X111-3N]
D11  BAS16LT3G  [SOT95P240X111-3N]
D12  BAS16LT3G  [SOT95P240X111-3N]
D13  BAS16LT3G  [SOT95P240X111-3N]
D14  BAS16LT3G  [SOT95P240X111-3N]
D15  BAS16LT3G  [SOT95P240X111-3N]
D16  BAS16LT3G  [SOT95P240X111-3N]
D17  BAS16LT3G  [SOT95P240X111-3N]
D18  BAS16LT3G  [SOT95P240X111-3N]
D19  BAS16LT3G  [SOT95P240X111-3N]
D20  BAS16LT3G  [SOT95P240X111-3N]
D21  BAS16LT3G  [SOT95P240X111-3N]
D22  BAS16LT3G  [SOT95P240X111-3N]
D23  BAS16LT3G  [SOT95P240X111-3N]
D24  BAS16LT3G  [SOT95P240X111-3N]
D25  BAS16LT3G  [SOT95P240X111-3N]
D26  BAS16LT3G  [SOT95P240X111-3N]
D27  BAS16LT3G  [SOT95P240X111-3N]
D28  BAS16LT3G  [SOT95P240X111-3N]
D29  BAS16LT3G  [SOT95P240X111-3N]
D30  BAS16LT3G  [SOT95P240X111-3N]
D31  BAS16LT3G  [SOT95P240X111-3N]
D32  BAS16LT3G  [SOT95P240X111-3N]
D33  BAS16LT3G  [SOT95P240X111-3N]
D34  BAS16LT3G  [SOT95P240X111-3N]
D35  BAS16LT3G  [SOT95P240X111-3N]
D36  BAS16LT3G  [SOT95P240X111-3N]
D37  BAS16LT3G  [SOT95P240X111-3N]
D38  BAS16LT3G  [SOT95P240X111-3N]
D39  BAS16LT3G  [SOT95P240X111-3N]
D40  BAS16LT3G  [SOT95P240X111-3N]
D41  BAS16LT3G  [SOT95P240X111-3N]
D42  BAS16LT3G  [SOT95P240X111-3N]
D43  BAS16LT3G  [SOT95P240X111-3N]
D44  BAS16LT3G  [SOT95P240X111-3N]
D45  BAS16LT3G  [SOT95P240X111-3N]
D46  BAS16LT3G  [SOT95P240X111-3N]
D47  BAS16LT3G  [SOT95P240X111-3N]
D48  BAS16LT3G  [SOT95P240X111-3N]
D49  BAS16LT3G  [SOT95P240X111-3N]
D50  BAS16LT3G  [SOT95P240X111-3N]
D51  BAS16LT3G  [SOT95P240X111-3N]
D52  BAS16LT3G  [SOT95P240X111-3N]
D53  BAS16LT3G  [SOT95P240X111-3N]
D54  BAS16LT3G  [SOT95P240X111-3N]
D55  BAS16LT3G  [SOT95P240X111-3N]
D56  BAS16LT3G  [SOT95P240X111-3N]
D57  BAS16LT3G  [SOT95P240X111-3N]
D58  BAS16LT3G  [SOT95P240X111-3N]
D59  BAS16LT3G  [SOT95P240X111-3N]
D60  BAS16LT3G  [SOT95P240X111-3N]
D61  BAS16LT3G  [SOT95P240X111-3N]
D62  BAS16LT3G  [SOT95P240X111-3N]
D63  BAS16LT3G  [SOT95P240X111-3N]
D64  BAS16LT3G  [SOT95P240X111-3N]
D65  BAS16LT3G  [SOT95P240X111-3N]
D66  BAS16LT3G  [SOT95P240X111-3N]
D67  BAS16LT3G  [SOT95P240X111-3N]
D68  BAS16LT3G  [SOT95P240X111-3N]
D69  BAS16LT3G  [SOT95P240X111-3N]
D70  BAS16LT3G  [SOT95P240X111-3N]
D71  BAS16LT3G  [SOT95P240X111-3N]
D72  BAS16LT3G  [SOT95P240X111-3N]
D73  BAS16LT3G  [SOT95P240X111-3N]
D74  BAS16LT3G  [SOT95P240X111-3N]
D75  BAS16LT3G  [SOT95P240X111-3N]
D76  BAS16LT3G  [SOT95P240X111-3N]
D77  BAS16LT3G  [SOT95P240X111-3N]
D78  BAS16LT3G  [SOT95P240X111-3N]
D79  BAS16LT3G  [SOT95P240X111-3N]
D80  BAS16LT3G  [SOT95P240X111-3N]
D81  BAS16LT3G  [SOT95P240X111-3N]
D82  BAS16LT3G  [SOT95P240X111-3N]
D83  BAS16LT3G  [SOT95P240X111-3N]
D84  BAS16LT3G  [SOT95P240X111-3N]
D85  BAS16LT3G  [SOT95P240X111-3N]
D86  BAS16LT3G  [SOT95P240X111-3N]
D87  BAS16LT3G  [SOT95P240X111-3N]
D88  BAS16LT3G  [SOT95P240X111-3N]
D89  BAS16LT3G  [SOT95P240X111-3N]
D90  BAS16LT3G  [SOT95P240X111-3N]
D91  BAS16LT3G  [SOT95P240X111-3N]
D92  BAS16LT3G  [SOT95P240X111-3N]
D93  BAS16LT3G  [SOT95P240X111-3N]
D94  BAS16LT3G  [SOT95P240X111-3N]
D95  BAS16LT3G  [SOT95P240X111-3N]
D96  BAS16LT3G  [SOT95P240X111-3N]
D97  BAS16LT3G  [SOT95P240X111-3N]
D98  BAS16LT3G  [SOT95P240X111-3N]
D99  BAS16LT3G  [SOT95P240X111-3N]
D100  BAS16LT3G  [SOT95P240X111-3N]
D101  BAS16LT3G  [SOT95P240X111-3N]
D102  BAS16LT3G  [SOT95P240X111-3N]
D103  BAS16LT3G  [SOT95P240X111-3N]
D104  BAS16LT3G  [SOT95P240X111-3N]
D105  BAS16LT3G  [SOT95P240X111-3N]
D106  BAS16LT3G  [SOT95P240X111-3N]
D107  BAS16LT3G  [SOT95P240X111-3N]
D108  BAS16LT3G  [SOT95P240X111-3N]
D109  BAS16LT3G  [SOT95P240X111-3N]
D110  BAS16LT3G  [SOT95P240X111-3N]
D111  BAS16LT3G  [SOT95P240X111-3N]
D112  BAS16LT3G  [SOT95P240X111-3N]
D113  BAS16LT3G  [SOT95P240X111-3N]
D114  BAS16LT3G  [SOT95P240X111-3N]
D115  BAS16LT3G  [SOT95P240X111-3N]
D116  BAS16LT3G  [SOT95P240X111-3N]
D117  BAS16LT3G  [SOT95P240X111-3N]
D118  BAS16LT3G  [SOT95P240X111-3N]
D119  BAS16LT3G  [SOT95P240X111-3N]
D120  BAS16LT3G  [SOT95P240X111-3N]
D121  BAS16LT3G  [SOT95P240X111-3N]
D122  BAS16LT3G  [SOT95P240X111-3N]
D123  BAS16LT3G  [SOT95P240X111-3N]
D124  BAS16LT3G  [SOT95P240X111-3N]
D125  BAS16LT3G  [SOT95P240X111-3N]
D126  BAS16LT3G  [SOT95P240X111-3N]
D127  BAS16LT3G  [SOT95P240X111-3N]
D128  BAS16LT3G  [SOT95P240X111-3N]
D129  BAS16LT3G  [SOT95P240X111-3N]
D130  BAS16LT3G  [SOT95P240X111-3N]
D131  BAS16LT3G  [SOT95P240X111-3N]
D132  BAS16LT3G  [SOT95P240X111-3N]
D133  BAS16LT3G  [SOT95P240X111-3N]
D134  BAS16LT3G  [SOT95P240X111-3N]
D135  BAS16LT3G  [SOT95P240X111-3N]
D136  BAS16LT3G  [SOT95P240X111-3N]
D137  BAS16LT3G  [SOT95P240X111-3N]
D138  BAS16LT3G  [SOT95P240X111-3N]
D139  BAS16LT3G  [SOT95P240X111-3N]
D140  BAS16LT3G  [SOT95P240X111-3N]
D141  BAS16LT3G  [SOT95P240X111-3N]
D142  BAS16LT3G  [SOT95P240X111-3N]
D143  BAS16LT3G  [SOT95P240X111-3N]
D144  BAS16LT3G  [SOT95P240X111-3N]
D145  BAS16LT3G  [SOT95P240X111-3N]
D146  BAS16LT3G  [SOT95P240X111-3N]
D147  BAS16LT3G  [SOT95P240X111-3N]
D148  BAS16LT3G  [SOT95P240X111-3N]
D149  BAS16LT3G  [SOT95P240X111-3N]
D150  BAS16LT3G  [SOT95P240X111-3N]
D151  BAS16LT3G  [SOT95P240X111-3N]
D152  BAS16LT3G  [SOT95P240X111-3N]
D153  BAS16LT3G  [SOT95P240X111-3N]
KEY_1  CHERRY-MX-LED  [CHERRY-MX-LED]
KEY_2  CHERRY-MX-LED  [CHERRY-MX-LED]
KEY_3  CHERRY-MX-LED  [CHERRY-MX-LED]
KEY_4  CHERRY-MX-LED  [CHERRY-MX-LED]
KEY_5  CHERRY-MX-LED  [CHERRY-MX-LED]
KEY_6  CHERRY-MX-LED  [CHERRY-MX-LED]
KEY_7  CHERRY-MX-LED  [CHERRY-MX-LED]
KEY_8  CHERRY-MX-LED  [CHERRY-MX-LED]
KEY_9  CHERRY-MX-LED  [CHERRY-MX-LED]
KEY_10  CHERRY-MX-LED  [CHERRY-MX-LED]
KEY_11  CHERRY-MX-LED  [CHERRY-MX-LED]
KEY_12  CHERRY-MX-LED  [CHERRY-MX-LED]
KEY_13  CHERRY-MX-LED  [CHERRY-MX-LED]
KEY_14  CHERRY-MX-LED  [CHERRY-MX-LED]
KEY_15  CHERRY-MX-LED  [CHERRY-MX-LED]
KEY_16  CHERRY-MX-LED  [CHERRY-MX-LED]
KEY_17  CHERRY-MX-LED  [CHERRY-MX-LED]
KEY_18  CHERRY-MX-LED  [CHERRY-MX-LED]
KEY_19  CHERRY-MX-LED  [CHERRY-MX-LED]
KEY_20  CHERRY-MX-LED  [CHERRY-MX-LED]
KEY_21  CHERRY-MX-LED  [CHERRY-MX-LED]
KEY_22  CHERRY-MX-LED  [CHERRY-MX-LED]
KEY_23  CHERRY-MX-LED  [CHERRY-MX-LED]
KEY_24  CHERRY-MX-LED  [CHERRY-MX-LED]
KEY_25  CHERRY-MX-LED  [CHERRY-MX-LED]
KEY_26  CHERRY-MX-LED  [CHERRY-MX-LED]
KEY_27  CHERRY-MX-LED  [CHERRY-MX-LED]
KEY_28  CHERRY-MX-LED  [CHERRY-MX-LED]
KEY_29  CHERRY-MX-LED  [CHERRY-MX-LED]
KEY_30  CHERRY-MX-LED  [CHERRY-MX-LED]
KEY_30_OFFSET  CHERRY-MX-LED-NOPIN  [CHERRY-MX-LED-NOPIN]
KEY_31  CHERRY-MX-LED  [CHERRY-MX-LED]
KEY_31_OFFSET  CHERRY-MX-LED-NOPIN  [CHERRY-MX-LED-NOPIN]
KEY_32  CHERRY-MX-LED  [CHERRY-MX-LED]
KEY_32_OFFSET  CHERRY-MX-LED-NOPIN  [CHERRY-MX-LED-NOPIN]
KEY_33  CHERRY-MX-LED  [CHERRY-MX-LED]
KEY_33_OFFSET  CHERRY-MX-LED-NOPIN  [CHERRY-MX-LED-NOPIN]
KEY_34  CHERRY-MX-LED  [CHERRY-MX-LED]
KEY_35  CHERRY-MX-LED  [CHERRY-MX-LED]
KEY_36  CHERRY-MX-LED  [CHERRY-MX-LED]
KEY_37  CHERRY-MX-LED  [CHERRY-MX-LED]
KEY_38  CHERRY-MX-LED  [CHERRY-MX-LED]
KEY_39  CHERRY-MX-LED  [CHERRY-MX-LED]
KEY_40  CHERRY-MX-LED  [CHERRY-MX-LED]
KEY_41  CHERRY-MX-LED  [CHERRY-MX-LED]
KEY_42  CHERRY-MX-LED  [CHERRY-MX-LED]
KEY_43  CHERRY-MX-LED  [CHERRY-MX-LED]
KEY_44  CHERRY-MX-LED  [CHERRY-MX-LED]
KEY_45  CHERRY-MX-LED  [CHERRY-MX-LED]
KEY_46  CHERRY-MX-LED  [CHERRY-MX-LED]
KEY_47  CHERRY-MX-LED  [CHERRY-MX-LED]
KEY_48  CHERRY-MX-LED  [CHERRY-MX-LED]
KEY_49  CHERRY-MX-LED  [CHERRY-MX-LED]
KEY_50  CHERRY-MX-LED  [CHERRY-MX-LED]
KEY_51  CHERRY-MX-LED  [CHERRY-MX-LED]
KEY_52  CHERRY-MX-LED  [CHERRY-MX-LED]
KEY_53  CHERRY-MX-LED  [CHERRY-MX-LED]
KEY_54  CHERRY-MX-LED  [CHERRY-MX-LED]
KEY_55  CHERRY-MX-LED  [CHERRY-MX-LED]
KEY_56  CHERRY-MX-LED  [CHERRY-MX-LED]
KEY_57  CHERRY-MX-LED  [CHERRY-MX-LED]
KEY_58  CHERRY-MX-LED  [CHERRY-MX-LED]
KEY_59  CHERRY-MX-LED  [CHERRY-MX-LED]
KEY_60  CHERRY-MX-LED  [CHERRY-MX-LED]
KEY_61  CHERRY-MX-LED  [CHERRY-MX-LED]
KEY_62  CHERRY-MX-LED  [CHERRY-MX-LED]
KEY_63  CHERRY-MX-LED  [CHERRY-MX-LED]
KEY_64  CHERRY-MX-LED  [CHERRY-MX-LED]
KEY_65  CHERRY-MX-LED  [CHERRY-MX-LED]
KEY_66  CHERRY-MX-LED  [CHERRY-MX-LED]
KEY_67  CHERRY-MX-LED  [CHERRY-MX-LED]
KEY_68  CHERRY-MX-LED  [CHERRY-MX-LED]
KEY_69  CHERRY-MX-LED  [CHERRY-MX-LED]
KEY_70  CHERRY-MX-LED  [CHERRY-MX-LED]
KEY_71  CHERRY-MX-LED  [CHERRY-MX-LED]
KEY_72  CHERRY-MX-LED  [CHERRY-MX-LED]
KEY_73  CHERRY-MX-LED  [CHERRY-MX-LED]
KEY_74  CHERRY-MX-LED  [CHERRY-MX-LED]
KEY_75  CHERRY-MX-LED  [CHERRY-MX-LED]
KEY_76  CHERRY-MX-LED  [CHERRY-MX-LED]
KEY_77  CHERRY-MX-LED  [CHERRY-MX-LED]
KEY_78  CHERRY-MX-LED  [CHERRY-MX-LED]
KEY_79  CHERRY-MX-LED  [CHERRY-MX-LED]
KEY_80  CHERRY-MX-LED  [CHERRY-MX-LED]
KEY_81  CHERRY-MX-LED  [CHERRY-MX-LED]
KEY_82  CHERRY-MX-LED  [CHERRY-MX-LED]
KEY_83  CHERRY-MX-LED  [CHERRY-MX-LED]
KEY_84  CHERRY-MX-LED  [CHERRY-MX-LED]
KEY_85  CHERRY-MX-LED  [CHERRY-MX-LED]
KEY_86  CHERRY-MX-LED  [CHERRY-MX-LED]
KEY_87  CHERRY-MX-LED  [CHERRY-MX-LED]
KEY_88  CHERRY-MX-LED  [CHERRY-MX-LED]
KEY_89  CHERRY-MX-LED  [CHERRY-MX-LED]
KEY_90  CHERRY-MX-LED  [CHERRY-MX-LED]
KEY_91  CHERRY-MX-LED  [CHERRY-MX-LED]
KEY_92  CHERRY-MX-LED  [CHERRY-MX-LED]
KEY_93  CHERRY-MX-LED  [CHERRY-MX-LED]
KEY_94  CHERRY-MX-LED  [CHERRY-MX-LED]
KEY_95  CHERRY-MX-LED  [CHERRY-MX-LED]
KEY_96  CHERRY-MX-LED  [CHERRY-MX-LED]
KEY_97  CHERRY-MX-LED  [CHERRY-MX-LED]
KEY_98  CHERRY-MX-LED  [CHERRY-MX-LED]
KEY_99  CHERRY-MX-LED  [CHERRY-MX-LED]
KEY_100  CHERRY-MX-LED  [CHERRY-MX-LED]
KEY_101  CHERRY-MX-LED  [CHERRY-MX-LED]
KEY_102  CHERRY-MX-LED  [CHERRY-MX-LED]
KEY_103  CHERRY-MX-LED  [CHERRY-MX-LED]
KEY_104  CHERRY-MX-LED  [CHERRY-MX-LED]
KEY_105  CHERRY-MX-LED  [CHERRY-MX-LED]
KEY_106  CHERRY-MX-LED  [CHERRY-MX-LED]
KEY_107  CHERRY-MX-LED  [CHERRY-MX-LED]
KEY_108  CHERRY-MX-LED  [CHERRY-MX-LED]
KEY_109  CHERRY-MX-LED  [CHERRY-MX-LED]
KEY_110  CHERRY-MX-LED  [CHERRY-MX-LED]
KEY_111  CHERRY-MX-LED  [CHERRY-MX-LED]
KEY_112  CHERRY-MX-LED  [CHERRY-MX-LED]
KEY_113  CHERRY-MX-LED  [CHERRY-MX-LED]
KEY_114  CHERRY-MX-LED  [CHERRY-MX-LED]
KEY_115  CHERRY-MX-LED  [CHERRY-MX-LED]
KEY_116  CHERRY-MX-LED  [CHERRY-MX-LED]
KEY_117  CHERRY-MX-LED  [CHERRY-MX-LED]
KEY_118  CHERRY-MX-LED  [CHERRY-MX-LED]
KEY_119  CHERRY-MX-LED  [CHERRY-MX-LED]
KEY_120  CHERRY-MX-LED  [CHERRY-MX-LED]
KEY_121  CHERRY-MX-LED  [CHERRY-MX-LED]
KEY_122  CHERRY-MX-LED  [CHERRY-MX-LED]
KEY_123  CHERRY-MX-LED  [CHERRY-MX-LED]
KEY_124  CHERRY-MX-LED  [CHERRY-MX-LED]
KEY_125  CHERRY-MX-LED  [CHERRY-MX-LED]
KEY_126  CHERRY-MX-LED  [CHERRY-MX-LED]
KEY_127  CHERRY-MX-LED  [CHERRY-MX-LED]
KEY_128  CHERRY-MX-LED  [CHERRY-MX-LED]
KEY_129  CHERRY-MX-LED  [CHERRY-MX-LED]
KEY_130  CHERRY-MX-LED  [CHERRY-MX-LED]
KEY_131  CHERRY-MX-LED  [CHERRY-MX-LED]
KEY_132  CHERRY-MX-LED  [CHERRY-MX-LED]
KEY_133  CHERRY-MX-LED  [CHERRY-MX-LED]
KEY_134  CHERRY-MX-LED  [CHERRY-MX-LED]
KEY_135  CHERRY-MX-LED  [CHERRY-MX-LED]
KEY_136  CHERRY-MX-LED  [CHERRY-MX-LED]
KEY_137  CHERRY-MX-LED  [CHERRY-MX-LED]
KEY_138  CHERRY-MX-LED  [CHERRY-MX-LED]
KEY_139  CHERRY-MX-LED  [CHERRY-MX-LED]
KEY_140  CHERRY-MX-LED  [CHERRY-MX-LED]
KEY_141  CHERRY-MX-LED  [CHERRY-MX-LED]
KEY_142  CHERRY-MX-LED  [CHERRY-MX-LED]
KEY_143  CHERRY-MX-LED  [CHERRY-MX-LED]
KEY_144  CHERRY-MX-LED  [CHERRY-MX-LED]
KEY_145  CHERRY-MX-LED  [CHERRY-MX-LED]
KEY_146  CHERRY-MX-LED  [CHERRY-MX-LED]
KEY_147  CHERRY-MX-LED  [CHERRY-MX-LED]
KEY_148  CHERRY-MX-LED  [CHERRY-MX-LED]
KEY_149  CHERRY-MX-LED  [CHERRY-MX-LED]
KEY_150  CHERRY-MX-LED  [CHERRY-MX-LED]
KEY_151  CHERRY-MX-LED  [CHERRY-MX-LED]
KEY_152  CHERRY-MX-LED  [CHERRY-MX-LED]
KEY_153  CHERRY-MX-LED  [CHERRY-MX-LED]
SJ2  SJW  [SJW]
SJ3  SJW  [SJW]
SJ4  SJW  [SJW]
SJ5  SJW  [SJW]
SJ6  SJW  [SJW]
SJ7  SJW  [SJW]
SJ8  SJW  [SJW]
SJ9  SJW  [SJW]
SJ10  SJW  [SJW]
SJ11  SJW  [SJW]
SJ12  SJW  [SJW]
SJ13  SJW  [SJW]
SJ14  SJW  [SJW]
SJ15  SJW  [SJW]
SJ16  SJW  [SJW]
SJ17  SJW  [SJW]
SJ18  SJW  [SJW]
SJ19  SJW  [SJW]
SJ20  SJW  [SJW]
SJ21  SJW  [SJW]
SJ22  SJW  [SJW]
SJ23  SJW  [SJW]
SJ24  SJW  [SJW]
SJ25  SJW  [SJW]
SJ26  SJW  [SJW]
SJ27  SJW  [SJW]
SJ28  SJW  [SJW]
SJ29  SJW  [SJW]
SJ30  SJW  [SJW]
SJ31  SJW  [SJW]
SJ32  SJW  [SJW]
SJ33  SJW  [SJW]
SJ34  SJW  [SJW]
SJ35  SJW  [SJW]
SJ36  SJW  [SJW]
SJ37  SJW  [SJW]
SJ38  SJW  [SJW]
SJ39  SJW  [SJW]
SJ40  SJW  [SJW]
SJ41  SJW  [SJW]
SJ42  SJW  [SJW]
SJ43  SJW  [SJW]
SJ44  SJW  [SJW]
SJ45  SJW  [SJW]
SJ46  SJW  [SJW]
SJ47  SJW  [SJW]
SJ48  SJW  [SJW]
SJ49  SJW  [SJW]
SJ50  SJW  [SJW]
SJ51  SJW  [SJW]
SJ52  SJW  [SJW]
SJ53  SJW  [SJW]
SJ54  SJW  [SJW]
SJ55  SJW  [SJW]
SJ56  SJW  [SJW]
SJ57  SJW  [SJW]
SJ58  SJW  [SJW]
SJ59  SJW  [SJW]
SJ60  SJW  [SJW]
SJ61  SJW  [SJW]
SJ62  SJW  [SJW]
SJ63  SJW  [SJW]
SJ64  SJW  [SJW]
SJ65  SJW  [SJW]
SJ66  SJW  [SJW]
SJ67  SJW  [SJW]
SJ68  SJW  [SJW]
SJ69  SJW  [SJW]
SJ70  SJW  [SJW]
SJ71  SJW  [SJW]
SJ72  SJW  [SJW]
SJ73  SJW  [SJW]
SJ74  SJW  [SJW]
SJ75  SJW  [SJW]
SJ76  SJW  [SJW]
SJ77  SJW  [SJW]
SJ78  SJW  [SJW]
SJ79  SJW  [SJW]
SJ80  SJW  [SJW]
SJ81  SJW  [SJW]
SJ82  SJW  [SJW]
SJ83  SJW  [SJW]
SJ84  SJW  [SJW]
SJ85  SJW  [SJW]
SJ86  SJW  [SJW]
SJ87  SJW  [SJW]

### Nets
COL_1: SJ33.2 ; also sheet 2
COL_1_XFUNC: KEY_21.SW1 KEY_45.SW1 KEY_68.SW1 KEY_91.SW1 KEY_113.SW1 KEY_133.SW1 SJ2.1 SJ33.1
COL_1_XFUNC_MACRO: KEY_1.SW1 SJ2.2
COL_2: SJ34.2 ; also sheet 2
COL_2_XFUNC: KEY_22.SW1 KEY_46.SW1 KEY_69.SW1 KEY_92.SW1 KEY_114.SW1 KEY_134.SW1 SJ3.1 SJ34.1
COL_2_XFUNC_MACRO: KEY_2.SW1 SJ3.2
COL_3: KEY_23.SW1 KEY_47.SW1 KEY_70.SW1 KEY_93.SW1 KEY_115.SW1 KEY_135.SW1 SJ4.1 ; also sheet 2
COL_3_MACRO: KEY_3.SW1 SJ4.2
COL_4: KEY_24.SW1 KEY_48.SW1 KEY_71.SW1 KEY_94.SW1 KEY_116.SW1 KEY_136.SW1 SJ5.1 ; also sheet 2
COL_4_MACRO: KEY_4.SW1 SJ5.2
COL_5: KEY_25.SW1 KEY_49.SW1 KEY_72.SW1 KEY_95.SW1 KEY_117.SW1 KEY_137.SW1 SJ6.1 ; also sheet 2
COL_5_MACRO: KEY_5.SW1 SJ6.2
COL_6: KEY_26.SW1 KEY_50.SW1 KEY_73.SW1 KEY_96.SW1 KEY_118.SW1 SJ7.1 ; also sheet 2
COL_6_MACRO: KEY_6.SW1 SJ7.2
COL_7: KEY_27.SW1 KEY_51.SW1 KEY_74.SW1 KEY_97.SW1 KEY_119.SW1 SJ8.1 ; also sheet 2
COL_7_MACRO: KEY_7.SW1 SJ8.2
COL_8: KEY_28.SW1 KEY_52.SW1 KEY_75.SW1 KEY_98.SW1 KEY_120.SW1 KEY_138.SW1 SJ9.1 ; also sheet 2
COL_8_MACRO: KEY_8.SW1 SJ9.2
COL_9: KEY_29.SW1 KEY_53.SW1 KEY_76.SW1 KEY_99.SW1 KEY_121.SW1 SJ10.1 ; also sheet 2
COL_9_MACRO: KEY_9.SW1 SJ10.2
COL_10: KEY_30.SW1 KEY_30_OFFSET.SW1 KEY_54.SW1 KEY_77.SW1 KEY_100.SW1 KEY_122.SW1 SJ11.1 ; also sheet 2
COL_10_MACRO: KEY_10.SW1 SJ11.2
COL_11: KEY_31.SW1 KEY_31_OFFSET.SW1 KEY_55.SW1 KEY_78.SW1 KEY_101.SW1 KEY_123.SW1 SJ12.1 ; also sheet 2
COL_11_MACRO: KEY_11.SW1 SJ12.2
COL_12: KEY_32.SW1 KEY_32_OFFSET.SW1 KEY_56.SW1 KEY_79.SW1 KEY_102.SW1 KEY_124.SW1 KEY_139.SW1 SJ13.1 ; also sheet 2
COL_12_MACRO: KEY_12.SW1 SJ13.2
COL_13: KEY_33.SW1 KEY_33_OFFSET.SW1 KEY_57.SW1 KEY_80.SW1 KEY_103.SW1 KEY_125.SW1 KEY_140.SW1 SJ14.1 ; also sheet 2
COL_13_MACRO: KEY_13.SW1 SJ14.2
COL_14: KEY_34.SW1 KEY_58.SW1 KEY_81.SW1 KEY_104.SW1 KEY_141.SW1 SJ15.1 ; also sheet 2
COL_14_MACRO: KEY_14.SW1 SJ15.2
COL_15: KEY_35.SW1 KEY_59.SW1 KEY_82.SW1 SJ16.1 ; also sheet 2
COL_15_MACRO: KEY_15.SW1 SJ16.2
COL_16: KEY_36.SW1 SJ17.1 ; also sheet 2
COL_16_MACRO: KEY_16.SW1 SJ17.2
COL_17: KEY_37.SW1 KEY_60.SW1 KEY_83.SW1 KEY_105.SW1 KEY_126.SW1 KEY_142.SW1 SJ18.1 ; also sheet 2
COL_17_MACRO: KEY_17.SW1 SJ18.2
COL_18: KEY_38.SW1 KEY_61.SW1 KEY_84.SW1 KEY_106.SW1 KEY_127.SW1 KEY_143.SW1 SJ19.1 ; also sheet 2
COL_18_MACRO: KEY_18.SW1 SJ19.2
COL_19: KEY_39.SW1 KEY_62.SW1 KEY_85.SW1 KEY_107.SW1 KEY_128.SW1 KEY_144.SW1 SJ20.1 ; also sheet 2
COL_19_MACRO: KEY_19.SW1 SJ20.2
COL_20: KEY_40.SW1 KEY_63.SW1 KEY_86.SW1 KEY_108.SW1 KEY_129.SW1 KEY_145.SW1 SJ21.1 ; also sheet 2
COL_20_MACRO: KEY_20.SW1 SJ21.2
COL_21: KEY_41.SW1 KEY_64.SW1 KEY_87.SW1 KEY_109.SW1 KEY_130.SW1 KEY_146.SW1 SJ22.1 ; also sheet 2
COL_21_MACRO: KEY_150.SW1 SJ22.2
COL_22: KEY_42.SW1 KEY_65.SW1 KEY_88.SW1 KEY_110.SW1 KEY_131.SW1 KEY_147.SW1 SJ23.1 ; also sheet 2
COL_22_MACRO: KEY_151.SW1 SJ23.2
COL_23: KEY_43.SW1 KEY_66.SW1 KEY_89.SW1 KEY_111.SW1 KEY_132.SW1 KEY_148.SW1 SJ24.1 ; also sheet 2
COL_23_MACRO: KEY_152.SW1 SJ24.2
COL_24: KEY_44.SW1 KEY_67.SW1 KEY_90.SW1 KEY_112.SW1 KEY_149.SW1 SJ25.1 ; also sheet 2
COL_24_MACRO: KEY_153.SW1 SJ25.2
LED_SINK_1_CTRL: SJ85.1 ; also sheet 4
LED_SINK_1_XFUNC: KEY_21.LED- KEY_22.LED- KEY_45.LED- KEY_46.LED- KEY_68.LED- KEY_69.LED- KEY_91.LED- KEY_92.LED- KEY_113.LED- KEY_114.LED- KEY_133.LED- KEY_134.LED- SJ47.1 SJ85.2
LED_SINK_1_XFUNC_MACRO: KEY_1.LED- KEY_2.LED- SJ47.2
LED_SINK_2: KEY_23.LED- KEY_24.LED- KEY_47.LED- KEY_48.LED- KEY_70.LED- KEY_71.LED- KEY_93.LED- KEY_94.LED- KEY_115.LED- KEY_116.LED- KEY_135.LED- KEY_136.LED- SJ48.1 ; also sheet 4
LED_SINK_2_MACRO: KEY_3.LED- KEY_4.LED- SJ48.2
LED_SINK_3: KEY_25.LED- KEY_26.LED- KEY_49.LED- KEY_50.LED- KEY_72.LED- KEY_73.LED- KEY_95.LED- KEY_96.LED- KEY_117.LED- KEY_118.LED- KEY_137.LED- SJ49.1 ; also sheet 4
LED_SINK_3_MACRO: KEY_5.LED- KEY_6.LED- SJ49.2
LED_SINK_4: KEY_27.LED- KEY_28.LED- KEY_51.LED- KEY_52.LED- KEY_74.LED- KEY_75.LED- KEY_97.LED- KEY_98.LED- KEY_119.LED- KEY_120.LED- KEY_138.LED- SJ50.1 ; also sheet 4
LED_SINK_4_MACRO: KEY_7.LED- KEY_8.LED- SJ50.2
LED_SINK_5: KEY_29.LED- KEY_30.LED- KEY_30_OFFSET.LED- KEY_53.LED- KEY_54.LED- KEY_76.LED- KEY_77.LED- KEY_99.LED- KEY_100.LED- KEY_121.LED- KEY_122.LED- SJ51.1 ; also sheet 4
LED_SINK_5_MACRO: KEY_9.LED- KEY_10.LED- SJ51.2
LED_SINK_6: KEY_31.LED- KEY_31_OFFSET.LED- KEY_32.LED- KEY_32_OFFSET.LED- KEY_55.LED- KEY_56.LED- KEY_78.LED- KEY_79.LED- KEY_101.LED- KEY_102.LED- KEY_123.LED- KEY_124.LED- KEY_139.LED- SJ52.1 ; also sheet 4
LED_SINK_6_MACRO: KEY_11.LED- KEY_12.LED- SJ52.2
LED_SINK_7: KEY_33.LED- KEY_33_OFFSET.LED- KEY_34.LED- KEY_57.LED- KEY_58.LED- KEY_80.LED- KEY_81.LED- KEY_103.LED- KEY_104.LED- KEY_125.LED- KEY_140.LED- KEY_141.LED- SJ53.1 ; also sheet 4
LED_SINK_7_MACRO: KEY_13.LED- KEY_14.LED- SJ53.2
LED_SINK_8: KEY_35.LED- KEY_36.LED- KEY_59.LED- KEY_82.LED- SJ54.1 ; also sheet 4
LED_SINK_8_MACRO: KEY_15.LED- KEY_16.LED- SJ54.2
LED_SINK_9: KEY_37.LED- KEY_38.LED- KEY_60.LED- KEY_61.LED- KEY_83.LED- KEY_84.LED- KEY_105.LED- KEY_106.LED- KEY_126.LED- KEY_127.LED- KEY_142.LED- KEY_143.LED- SJ55.1 ; also sheet 4
LED_SINK_9_MACRO: KEY_17.LED- KEY_18.LED- SJ55.2
LED_SINK_10: KEY_39.LED- KEY_40.LED- KEY_62.LED- KEY_63.LED- KEY_85.LED- KEY_86.LED- KEY_107.LED- KEY_108.LED- KEY_128.LED- KEY_129.LED- KEY_144.LED- KEY_145.LED- SJ56.1 ; also sheet 4
LED_SINK_10_MACRO: KEY_19.LED- KEY_20.LED- SJ56.2
LED_SINK_11: KEY_41.LED- KEY_42.LED- KEY_64.LED- KEY_65.LED- KEY_87.LED- KEY_88.LED- KEY_109.LED- KEY_110.LED- KEY_130.LED- KEY_131.LED- KEY_146.LED- KEY_147.LED- SJ57.1 SJ86.1
LED_SINK_11_CTRL: SJ86.2 ; also sheet 4
LED_SINK_11_MACRO: KEY_150.LED- KEY_151.LED- SJ57.2
LED_SINK_12: KEY_43.LED- KEY_44.LED- KEY_66.LED- KEY_67.LED- KEY_89.LED- KEY_90.LED- KEY_111.LED- KEY_112.LED- KEY_132.LED- KEY_148.LED- KEY_149.LED- SJ58.1 SJ87.1
LED_SINK_12_CTRL: SJ87.2 ; also sheet 4
LED_SINK_12_MACRO: KEY_152.LED- KEY_153.LED- SJ58.2
LED_SORUCE_9_NUM: KEY_109.LED+ KEY_111.LED+ SJ73.1
LED_SORUCE_10_XFUNC: KEY_92.LED+ SJ72.2
LED_SOURCE_1_CTRL: SJ83.2 ; also sheet 4
LED_SOURCE_1_NUM: KEY_150.LED+ KEY_152.LED+ SJ44.1
LED_SOURCE_1_QWERTY: KEY_3.LED+ KEY_5.LED+ KEY_7.LED+ KEY_9.LED+ KEY_11.LED+ KEY_13.LED+ KEY_15.LED+ KEY_17.LED+ KEY_19.LED+ SJ44.2 SJ45.1 SJ83.1
LED_SOURCE_1_XFUNC: KEY_1.LED+ SJ45.2
LED_SOURCE_2_CTRL: SJ84.2 ; also sheet 4
LED_SOURCE_2_NUM: KEY_151.LED+ KEY_153.LED+ SJ43.1
LED_SOURCE_2_QWERY: KEY_4.LED+ KEY_6.LED+ KEY_8.LED+ KEY_10.LED+ KEY_12.LED+ KEY_14.LED+ KEY_16.LED+ KEY_18.LED+ KEY_20.LED+ SJ43.2 SJ46.1 SJ84.1
LED_SOURCE_2_XFUNC: KEY_2.LED+ SJ46.2
LED_SOURCE_3_NUM: KEY_41.LED+ KEY_43.LED+ SJ61.1
LED_SOURCE_3_QWERTY: KEY_23.LED+ KEY_25.LED+ KEY_27.LED+ KEY_29.LED+ KEY_31.LED+ KEY_31_OFFSET.LED+ KEY_33.LED+ KEY_33_OFFSET.LED+ KEY_35.LED+ KEY_37.LED+ KEY_39.LED+ SJ59.2 SJ61.2 ; also sheet 4
LED_SOURCE_3_XFUNC: KEY_21.LED+ SJ59.1
LED_SOURCE_4_NUM: KEY_42.LED+ KEY_44.LED+ SJ62.1
LED_SOURCE_4_QWERTY: KEY_24.LED+ KEY_26.LED+ KEY_28.LED+ KEY_30.LED+ KEY_30_OFFSET.LED+ KEY_32.LED+ KEY_32_OFFSET.LED+ KEY_34.LED+ KEY_36.LED+ KEY_38.LED+ KEY_40.LED+ SJ60.2 SJ62.2 ; also sheet 4
LED_SOURCE_4_XFUNC: KEY_22.LED+ SJ60.1
LED_SOURCE_5_NUM: KEY_64.LED+ KEY_66.LED+ SJ65.1
LED_SOURCE_5_QWERTY: KEY_47.LED+ KEY_49.LED+ KEY_51.LED+ KEY_53.LED+ KEY_55.LED+ KEY_57.LED+ KEY_59.LED+ KEY_60.LED+ KEY_62.LED+ SJ63.2 SJ65.2 ; also sheet 4
LED_SOURCE_5_XFUNC: KEY_45.LED+ SJ63.1
LED_SOURCE_6_NUM: KEY_65.LED+ KEY_67.LED+ SJ66.1
LED_SOURCE_6_QWERTY: KEY_48.LED+ KEY_50.LED+ KEY_52.LED+ KEY_54.LED+ KEY_56.LED+ KEY_58.LED+ KEY_61.LED+ KEY_63.LED+ SJ64.2 SJ66.2 ; also sheet 4
LED_SOURCE_6_XFUNC: KEY_46.LED+ SJ64.1
LED_SOURCE_7_NUM: KEY_87.LED+ KEY_89.LED+ SJ69.1
LED_SOURCE_7_QWERTY: KEY_70.LED+ KEY_72.LED+ KEY_74.LED+ KEY_76.LED+ KEY_78.LED+ KEY_80.LED+ KEY_82.LED+ KEY_83.LED+ KEY_85.LED+ SJ67.1 SJ69.2 ; also sheet 4
LED_SOURCE_7_XFUNC: KEY_68.LED+ SJ67.2
LED_SOURCE_8_NUM: KEY_88.LED+ KEY_90.LED+ SJ70.1
LED_SOURCE_8_QWERTY: KEY_71.LED+ KEY_73.LED+ KEY_75.LED+ KEY_77.LED+ KEY_79.LED+ KEY_81.LED+ KEY_84.LED+ KEY_86.LED+ SJ68.1 SJ70.2 ; also sheet 4
LED_SOURCE_8_XFUNC: KEY_69.LED+ SJ68.2
LED_SOURCE_9_QWERTY: KEY_93.LED+ KEY_95.LED+ KEY_97.LED+ KEY_99.LED+ KEY_101.LED+ KEY_103.LED+ KEY_105.LED+ KEY_107.LED+ SJ71.1 SJ73.2 ; also sheet 4
LED_SOURCE_9_XFUNC: KEY_91.LED+ SJ71.2
LED_SOURCE_10_NUM: KEY_110.LED+ KEY_112.LED+ SJ74.1
LED_SOURCE_10_QWERTY: KEY_94.LED+ KEY_96.LED+ KEY_98.LED+ KEY_100.LED+ KEY_102.LED+ KEY_104.LED+ KEY_106.LED+ KEY_108.LED+ SJ72.1 SJ74.2 ; also sheet 4
LED_SOURCE_11_NUM: KEY_130.LED+ KEY_132.LED+ SJ77.1
LED_SOURCE_11_QWERTY: KEY_115.LED+ KEY_117.LED+ KEY_119.LED+ KEY_121.LED+ KEY_123.LED+ KEY_125.LED+ KEY_126.LED+ KEY_128.LED+ SJ75.1 SJ77.2 ; also sheet 4
LED_SOURCE_11_XFUNC: KEY_113.LED+ SJ75.2
LED_SOURCE_12_NUM: KEY_131.LED+ SJ78.1
LED_SOURCE_12_QWERTY: KEY_116.LED+ KEY_118.LED+ KEY_120.LED+ KEY_122.LED+ KEY_124.LED+ KEY_127.LED+ KEY_129.LED+ SJ76.1 SJ78.2 ; also sheet 4
LED_SOURCE_12_XFUNC: KEY_114.LED+ SJ76.2
LED_SOURCE_13_NUM: KEY_146.LED+ KEY_148.LED+ SJ81.1
LED_SOURCE_13_QWERTY: KEY_135.LED+ KEY_137.LED+ KEY_140.LED+ KEY_142.LED+ KEY_144.LED+ SJ79.1 SJ81.2 ; also sheet 4
LED_SOURCE_13_XFUNC: KEY_133.LED+ SJ79.2
LED_SOURCE_14_NUM: KEY_147.LED+ KEY_149.LED+ SJ82.1
LED_SOURCE_14_QWERTY: KEY_136.LED+ KEY_138.LED+ KEY_139.LED+ KEY_141.LED+ KEY_143.LED+ KEY_145.LED+ SJ80.1 SJ82.2 ; also sheet 4
LED_SOURCE_14_XFUNC: KEY_134.LED+ SJ80.2
N$6: D1.3(C) KEY_1.SW2
N$7: D2.3(C) KEY_2.SW2
N$8: D3.3(C) KEY_3.SW2
N$9: D4.3(C) KEY_4.SW2
N$11: D5.3(C) KEY_5.SW2
N$12: D6.3(C) KEY_6.SW2
N$13: D7.3(C) KEY_7.SW2
N$15: D8.3(C) KEY_8.SW2
N$17: D9.3(C) KEY_9.SW2
N$19: D10.3(C) KEY_10.SW2
N$20: D31.3(C) KEY_31.SW2 KEY_31_OFFSET.SW2
N$21: D11.3(C) KEY_11.SW2
N$22: D40.3(C) KEY_40.SW2
N$23: D12.3(C) KEY_12.SW2
N$24: D39.3(C) KEY_39.SW2
N$25: D13.3(C) KEY_13.SW2
N$26: D25.3(C) KEY_25.SW2
N$27: D14.3(C) KEY_14.SW2
N$28: D38.3(C) KEY_38.SW2
N$29: D15.3(C) KEY_15.SW2
N$30: D35.3(C) KEY_35.SW2
N$31: D16.3(C) KEY_16.SW2
N$32: D34.3(C) KEY_34.SW2
N$33: D17.3(C) KEY_17.SW2
N$34: D37.3(C) KEY_37.SW2
N$35: D18.3(C) KEY_18.SW2
N$36: D30.3(C) KEY_30.SW2 KEY_30_OFFSET.SW2
N$37: D19.3(C) KEY_19.SW2
N$38: D36.3(C) KEY_36.SW2
N$39: D20.3(C) KEY_20.SW2
N$40: D33.3(C) KEY_33.SW2 KEY_33_OFFSET.SW2
N$41: D23.3(C) KEY_23.SW2
N$42: D32.3(C) KEY_32.SW2 KEY_32_OFFSET.SW2
N$43: D29.3(C) KEY_29.SW2
N$44: D24.3(C) KEY_24.SW2
N$45: D28.3(C) KEY_28.SW2
N$47: D27.3(C) KEY_27.SW2
N$48: D22.3(C) KEY_22.SW2
N$49: D26.3(C) KEY_26.SW2
N$51: D21.3(C) KEY_21.SW2
N$62: D45.3(C) KEY_45.SW2
N$63: D41.3(C) KEY_41.SW2
N$64: D46.3(C) KEY_46.SW2
N$66: D67.3(C) KEY_67.SW2
N$67: D66.3(C) KEY_66.SW2
N$68: D68.3(C) KEY_68.SW2
N$69: D65.3(C) KEY_65.SW2
N$70: D64.3(C) KEY_64.SW2
N$71: D63.3(C) KEY_63.SW2
N$72: D62.3(C) KEY_62.SW2
N$73: D61.3(C) KEY_61.SW2
N$74: D52.3(C) KEY_52.SW2
N$75: D49.3(C) KEY_49.SW2
N$76: D60.3(C) KEY_60.SW2
N$77: D51.3(C) KEY_51.SW2
N$78: D59.3(C) KEY_59.SW2
N$80: D58.3(C) KEY_58.SW2
N$81: D57.3(C) KEY_57.SW2
N$82: D50.3(C) KEY_50.SW2
N$83: D48.3(C) KEY_48.SW2
N$84: D56.3(C) KEY_56.SW2
N$85: D69.3(C) KEY_69.SW2
N$86: D55.3(C) KEY_55.SW2
N$87: D47.3(C) KEY_47.SW2
N$88: D54.3(C) KEY_54.SW2
N$89: D90.3(C) KEY_90.SW2
N$90: D53.3(C) KEY_53.SW2
N$91: D150.3(C) KEY_150.SW2
N$92: D89.3(C) KEY_89.SW2
N$93: D87.3(C) KEY_87.SW2
N$94: D70.3(C) KEY_70.SW2
N$95: D88.3(C) KEY_88.SW2
N$96: D83.3(C) KEY_83.SW2
N$97: D86.3(C) KEY_86.SW2
N$98: D71.3(C) KEY_71.SW2
N$99: D151.3(C) KEY_151.SW2
N$100: D72.3(C) KEY_72.SW2
N$101: D84.3(C) KEY_84.SW2
N$102: D73.3(C) KEY_73.SW2
N$104: D74.3(C) KEY_74.SW2
N$105: D85.3(C) KEY_85.SW2
N$106: D75.3(C) KEY_75.SW2
N$107: D112.3(C) KEY_112.SW2
N$108: D76.3(C) KEY_76.SW2
N$109: D111.3(C) KEY_111.SW2
N$110: D77.3(C) KEY_77.SW2
N$111: D110.3(C) KEY_110.SW2
N$112: D78.3(C) KEY_78.SW2
N$113: D96.3(C) KEY_96.SW2
N$114: D79.3(C) KEY_79.SW2
N$115: D109.3(C) KEY_109.SW2
N$116: D80.3(C) KEY_80.SW2
N$117: D113.3(C) KEY_113.SW2
N$118: D81.3(C) KEY_81.SW2
N$119: D108.3(C) KEY_108.SW2
N$120: D82.3(C) KEY_82.SW2
N$121: D100.3(C) KEY_100.SW2
N$122: D107.3(C) KEY_107.SW2
N$123: D106.3(C) KEY_106.SW2
N$124: D152.3(C) KEY_152.SW2
N$125: D99.3(C) KEY_99.SW2
N$126: D105.3(C) KEY_105.SW2
N$127: D104.3(C) KEY_104.SW2
N$128: D95.3(C) KEY_95.SW2
N$129: D103.3(C) KEY_103.SW2
N$130: D98.3(C) KEY_98.SW2
N$131: D97.3(C) KEY_97.SW2
N$132: D102.3(C) KEY_102.SW2
N$133: D101.3(C) KEY_101.SW2
N$134: D114.3(C) KEY_114.SW2
N$135: D94.3(C) KEY_94.SW2
N$136: D132.3(C) KEY_132.SW2
N$137: D93.3(C) KEY_93.SW2
N$138: D153.3(C) KEY_153.SW2
N$139: D92.3(C) KEY_92.SW2
N$140: D91.3(C) KEY_91.SW2
N$141: D131.3(C) KEY_131.SW2
N$142: D129.3(C) KEY_129.SW2
N$143: D130.3(C) KEY_130.SW2
N$144: D128.3(C) KEY_128.SW2
N$145: D124.3(C) KEY_124.SW2
N$146: D127.3(C) KEY_127.SW2
N$147: D125.3(C) KEY_125.SW2
N$148: D126.3(C) KEY_126.SW2
N$149: D133.3(C) KEY_133.SW2
N$150: D123.3(C) KEY_123.SW2
N$152: D122.3(C) KEY_122.SW2
N$153: D134.3(C) KEY_134.SW2
N$154: D121.3(C) KEY_121.SW2
N$155: D149.3(C) KEY_149.SW2
N$156: D120.3(C) KEY_120.SW2
N$157: D42.3(C) KEY_42.SW2
N$158: D119.3(C) KEY_119.SW2
N$159: D146.3(C) KEY_146.SW2
N$160: D118.3(C) KEY_118.SW2
N$161: D148.3(C) KEY_148.SW2
N$162: D117.3(C) KEY_117.SW2
N$163: D144.3(C) KEY_144.SW2
N$164: D116.3(C) KEY_116.SW2
N$165: D147.3(C) KEY_147.SW2
N$166: D145.3(C) KEY_145.SW2
N$167: D115.3(C) KEY_115.SW2
N$168: D143.3(C) KEY_143.SW2
N$169: D135.3(C) KEY_135.SW2
N$171: D142.3(C) KEY_142.SW2
N$172: D141.3(C) KEY_141.SW2
N$174: D140.3(C) KEY_140.SW2
N$176: D139.3(C) KEY_139.SW2
N$177: D43.3(C) KEY_43.SW2
N$178: D138.3(C) KEY_138.SW2
N$180: D137.3(C) KEY_137.SW2
N$183: D136.3(C) KEY_136.SW2
N$184: D44.3(C) KEY_44.SW2
ROW_1: SJ35.2 ; also sheet 2
ROW_1_NUM: D150.1(A) D151.1(A) D152.1(A) D153.1(A) SJ36.1
ROW_1_QWERTY: D3.1(A) D4.1(A) D5.1(A) D6.1(A) D7.1(A) D8.1(A) D9.1(A) D10.1(A) D11.1(A) D12.1(A) D13.1(A) D14.1(A) D15.1(A) D16.1(A) D17.1(A) D18.1(A) D19.1(A) D20.1(A) SJ26.1 SJ35.1 SJ36.2
ROW_1_XFUNC: D1.1(A) D2.1(A) SJ26.2
ROW_2_NUM: D41.1(A) D42.1(A) D43.1(A) D44.1(A) SJ37.1
ROW_2_QWERTY: D23.1(A) D24.1(A) D25.1(A) D26.1(A) D27.1(A) D28.1(A) D29.1(A) D30.1(A) D31.1(A) D32.1(A) D33.1(A) D34.1(A) D35.1(A) D36.1(A) D37.1(A) D38.1(A) D39.1(A) D40.1(A) SJ27.1 SJ37.2 ; also sheet 2
ROW_2_XFUNC: D21.1(A) D22.1(A) SJ27.2
ROW_3_NUM: D64.1(A) D65.1(A) D66.1(A) D67.1(A) SJ38.1
ROW_3_QWERTY: D47.1(A) D48.1(A) D49.1(A) D50.1(A) D51.1(A) D52.1(A) D53.1(A) D54.1(A) D55.1(A) D56.1(A) D57.1(A) D58.1(A) D59.1(A) D60.1(A) D61.1(A) D62.1(A) D63.1(A) SJ28.1 SJ38.2 ; also sheet 2
ROW_3_XFUNC: D45.1(A) D46.1(A) SJ28.2
ROW_4_NUM: D87.1(A) D88.1(A) D89.1(A) D90.1(A) SJ39.1
ROW_4_QWERTY: D70.1(A) D71.1(A) D72.1(A) D73.1(A) D74.1(A) D75.1(A) D76.1(A) D77.1(A) D78.1(A) D79.1(A) D80.1(A) D81.1(A) D82.1(A) D83.1(A) D84.1(A) D85.1(A) D86.1(A) SJ29.1 SJ39.2 ; also sheet 2
ROW_4_XFUNC: D68.1(A) D69.1(A) SJ29.2
ROW_5_NUM: D109.1(A) D110.1(A) D111.1(A) D112.1(A) SJ40.1
ROW_5_QWERTY: D93.1(A) D94.1(A) D95.1(A) D96.1(A) D97.1(A) D98.1(A) D99.1(A) D100.1(A) D101.1(A) D102.1(A) D103.1(A) D104.1(A) D105.1(A) D106.1(A) D107.1(A) D108.1(A) SJ30.1 SJ40.2 ; also sheet 2
ROW_5_XFUNC: D91.1(A) D92.1(A) SJ30.2
ROW_6_NUM: D130.1(A) D131.1(A) D132.1(A) SJ41.1
ROW_6_QWERTY: D115.1(A) D116.1(A) D117.1(A) D118.1(A) D119.1(A) D120.1(A) D121.1(A) D122.1(A) D123.1(A) D124.1(A) D125.1(A) D126.1(A) D127.1(A) D128.1(A) D129.1(A) SJ31.1 SJ41.2 ; also sheet 2
ROW_6_XFUNC: D113.1(A) D114.1(A) SJ31.2
ROW_7_NUM: D146.1(A) D147.1(A) D148.1(A) D149.1(A) SJ42.1
ROW_7_QWERTY: D135.1(A) D136.1(A) D137.1(A) D138.1(A) D139.1(A) D140.1(A) D141.1(A) D142.1(A) D143.1(A) D144.1(A) D145.1(A) SJ32.1 SJ42.2 ; also sheet 2
ROW_7_XFUNC: D133.1(A) D134.1(A) SJ32.2

### Notes on the sheet
- Cut Point
- Cut Point
- Cut Point

## Sheet 4 of 4: LED Controller
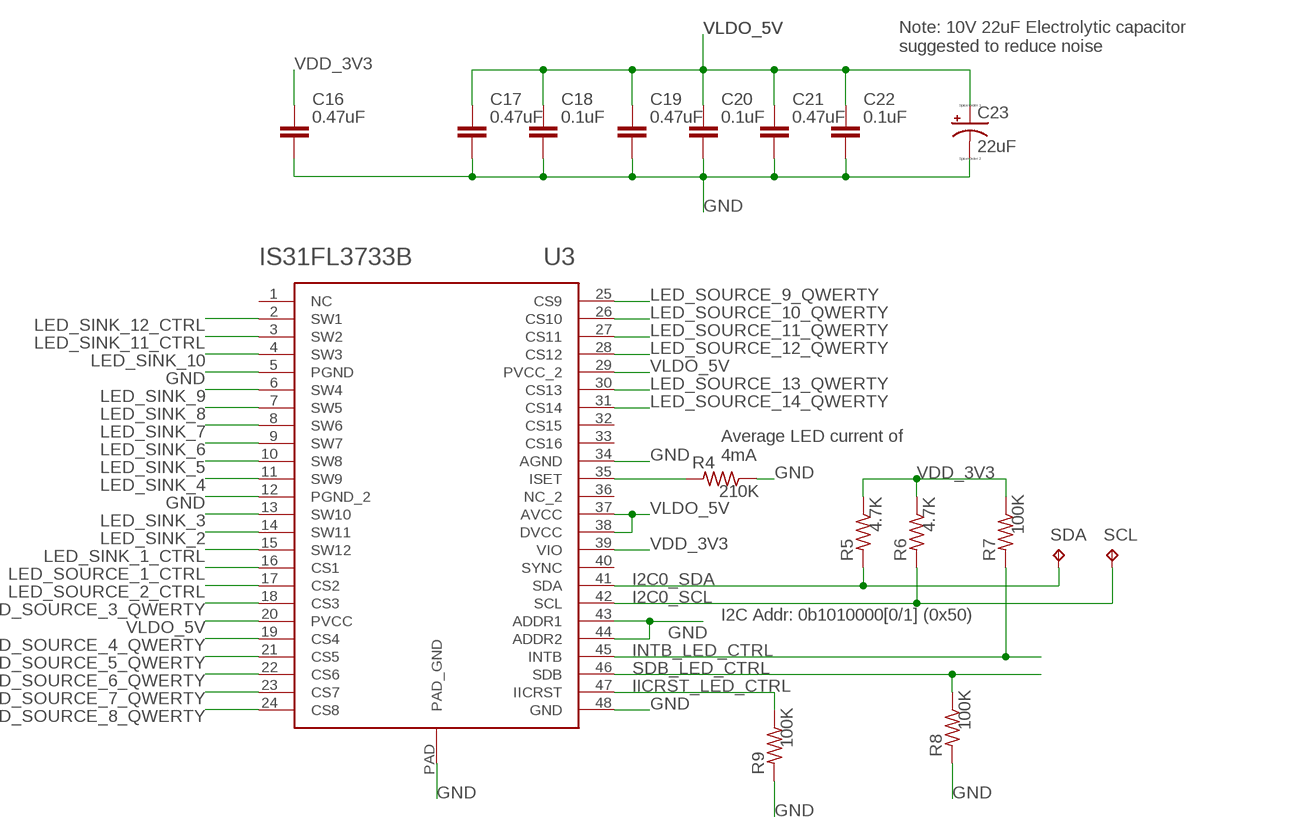
[diagram p5: schematic, sheet 4]

### Parts
C16  0.47uF  C_CHIP-0805(2012-METRIC)  [CAPC2012X110]
C17  0.47uF  C_CHIP-0805(2012-METRIC)  [CAPC2012X110]
C18  0.1uF  C_CHIP-0805(2012-METRIC)  [CAPC2012X110]
C19  0.47uF  C_CHIP-0805(2012-METRIC)  [CAPC2012X110]
C20  0.1uF  C_CHIP-0805(2012-METRIC)  [CAPC2012X110]
C21  0.47uF  C_CHIP-0805(2012-METRIC)  [CAPC2012X110]
C22  0.1uF  C_CHIP-0805(2012-METRIC)  [CAPC2012X110]
C23  22uF  860020672011  [860020672011]
R4  210K  R-US_CHIP-0805(2012-METRIC)  [RESC2012X65]
R5  4.7K  R-US_CHIP-0805(2012-METRIC)  [RESC2012X65]
R6  4.7K  R-US_CHIP-0805(2012-METRIC)  [RESC2012X65]
R7  100K  R-US_CHIP-0805(2012-METRIC)  [RESC2012X65]
R8  100K  R-US_CHIP-0805(2012-METRIC)  [RESC2012X65]
R9  100K  R-US_CHIP-0805(2012-METRIC)  [RESC2012X65]
SCL  TPB2,54  [B2,54]
SDA  TPB2,54  [B2,54]
U3  IS31FL3733B-TQLS4  [IS31FL3733B-TQLS4]

### Nets
GND: C16.2 C17.2 C18.2 C19.2 C20.2 C21.2 C22.2 C23.- R4.1 R8.2 R9.2 U3.5(PGND) U3.12(PGND_2) U3.34(AGND) U3.43(ADDR1) U3.44(ADDR2) U3.48(GND) U3.PAD(PAD_GND) ; also sheet 1,2
I2C0_SCL: R6.2 SCL.TP U3.42(SCL) ; also sheet 1
I2C0_SDA: R5.2 SDA.TP U3.41(SDA) ; also sheet 1
IICRST_LED_CTRL: R9.1 U3.47(IICRST)
INTB_LED_CTRL: R7.2 U3.45(INTB) ; also sheet 1
LED_SINK_1_CTRL: U3.15(SW12) ; also sheet 3
LED_SINK_2: U3.14(SW11) ; also sheet 3
LED_SINK_3: U3.13(SW10) ; also sheet 3
LED_SINK_4: U3.11(SW9) ; also sheet 3
LED_SINK_5: U3.10(SW8) ; also sheet 3
LED_SINK_6: U3.9(SW7) ; also sheet 3
LED_SINK_7: U3.8(SW6) ; also sheet 3
LED_SINK_8: U3.7(SW5) ; also sheet 3
LED_SINK_9: U3.6(SW4) ; also sheet 3
LED_SINK_10: U3.4(SW3) ; also sheet 3
LED_SINK_11_CTRL: U3.3(SW2) ; also sheet 3
LED_SINK_12_CTRL: U3.2(SW1) ; also sheet 3
LED_SOURCE_1_CTRL: U3.16(CS1) ; also sheet 3
LED_SOURCE_2_CTRL: U3.17(CS2) ; also sheet 3
LED_SOURCE_3_QWERTY: U3.18(CS3) ; also sheet 3
LED_SOURCE_4_QWERTY: U3.19(CS4) ; also sheet 3
LED_SOURCE_5_QWERTY: U3.21(CS5) ; also sheet 3
LED_SOURCE_6_QWERTY: U3.22(CS6) ; also sheet 3
LED_SOURCE_7_QWERTY: U3.23(CS7) ; also sheet 3
LED_SOURCE_8_QWERTY: U3.24(CS8) ; also sheet 3
LED_SOURCE_9_QWERTY: U3.25(CS9) ; also sheet 3
LED_SOURCE_10_QWERTY: U3.26(CS10) ; also sheet 3
LED_SOURCE_11_QWERTY: U3.27(CS11) ; also sheet 3
LED_SOURCE_12_QWERTY: U3.28(CS12) ; also sheet 3
LED_SOURCE_13_QWERTY: U3.30(CS13) ; also sheet 3
LED_SOURCE_14_QWERTY: U3.31(CS14) ; also sheet 3
N$3: R4.2 U3.35(ISET)
SDB_LED_CTRL: R8.1 U3.46(SDB) ; also sheet 1
VDD_3V3: C16.1 R5.1 R6.1 R7.1 U3.39(VIO) ; also sheet 1,2
VLDO_5V: C17.1 C18.1 C19.1 C20.1 C21.1 C22.1 C23.+ U3.20(PVCC) U3.29(PVCC_2) U3.37(AVCC) U3.38(DVCC) ; also sheet 2
Unconnected: U3.1(NC) U3.32(CS15) U3.33(CS16) U3.36(NC_2) U3.40(SYNC)

### Notes on the sheet
- Note: 10V 22uF Electrolytic capacitor 
  suggested to reduce noise
- Average LED current of
  4mA
- I2C Addr: 0b1010000[0/1] (0x50)